# EAGLE design minimatrixV1 (EAGLE 5.11)
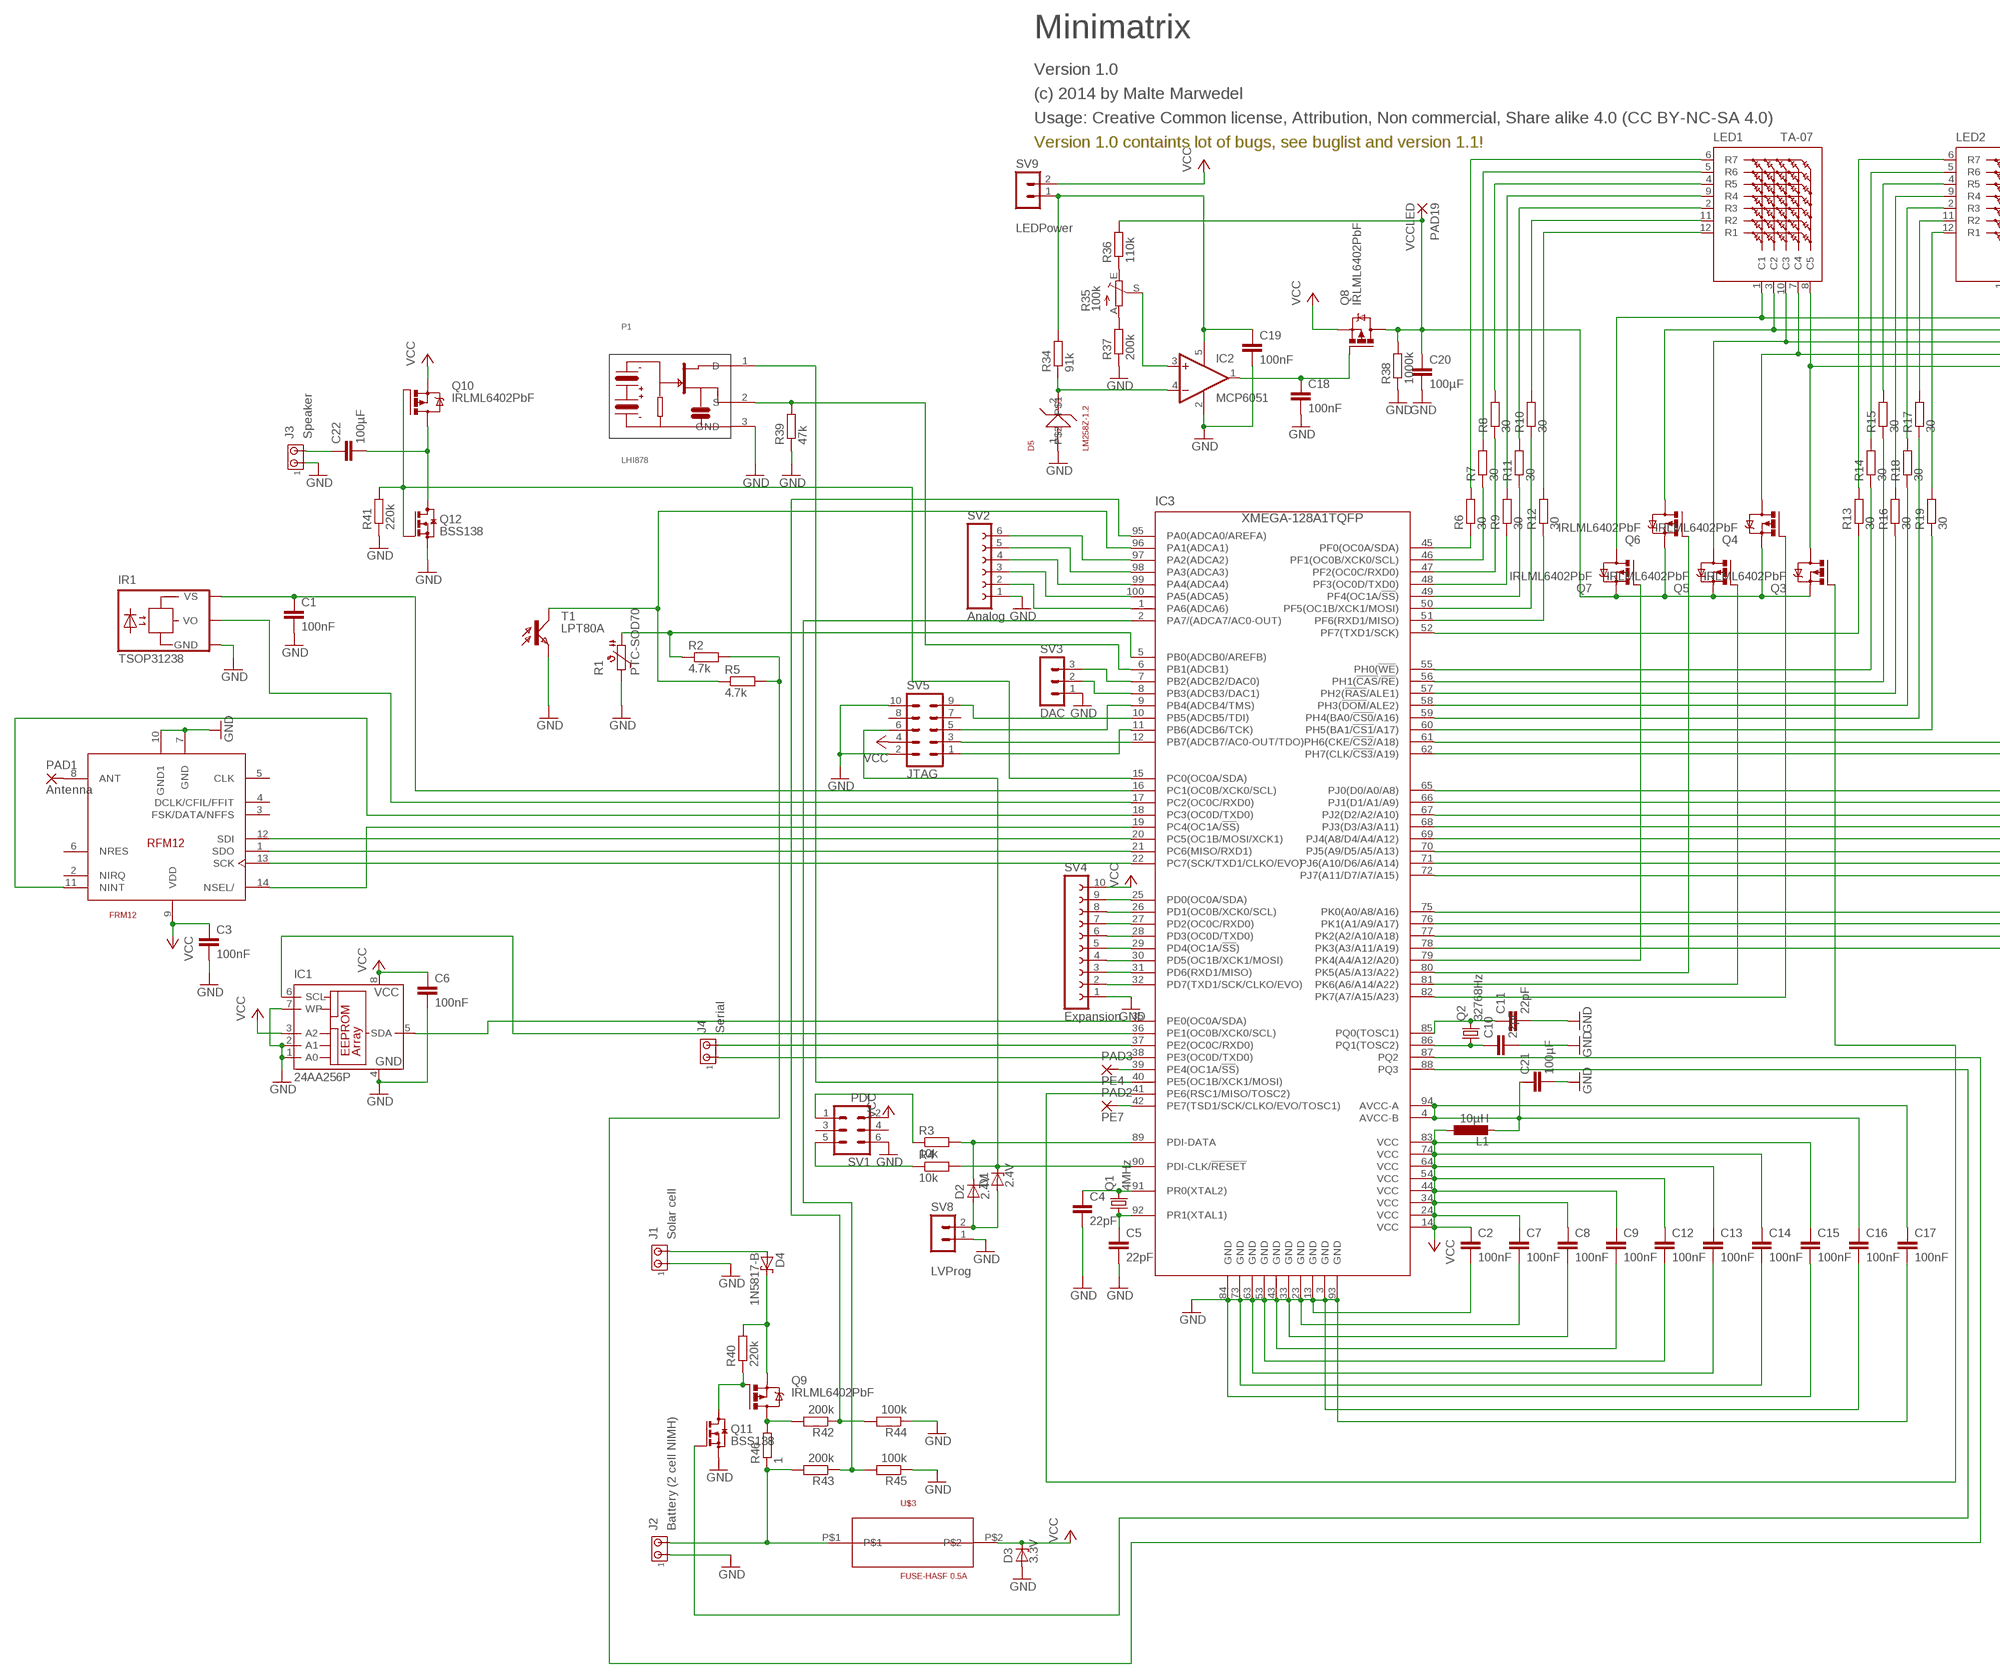
[diagram p0: schematic, sheet 1, part 1 of 2]
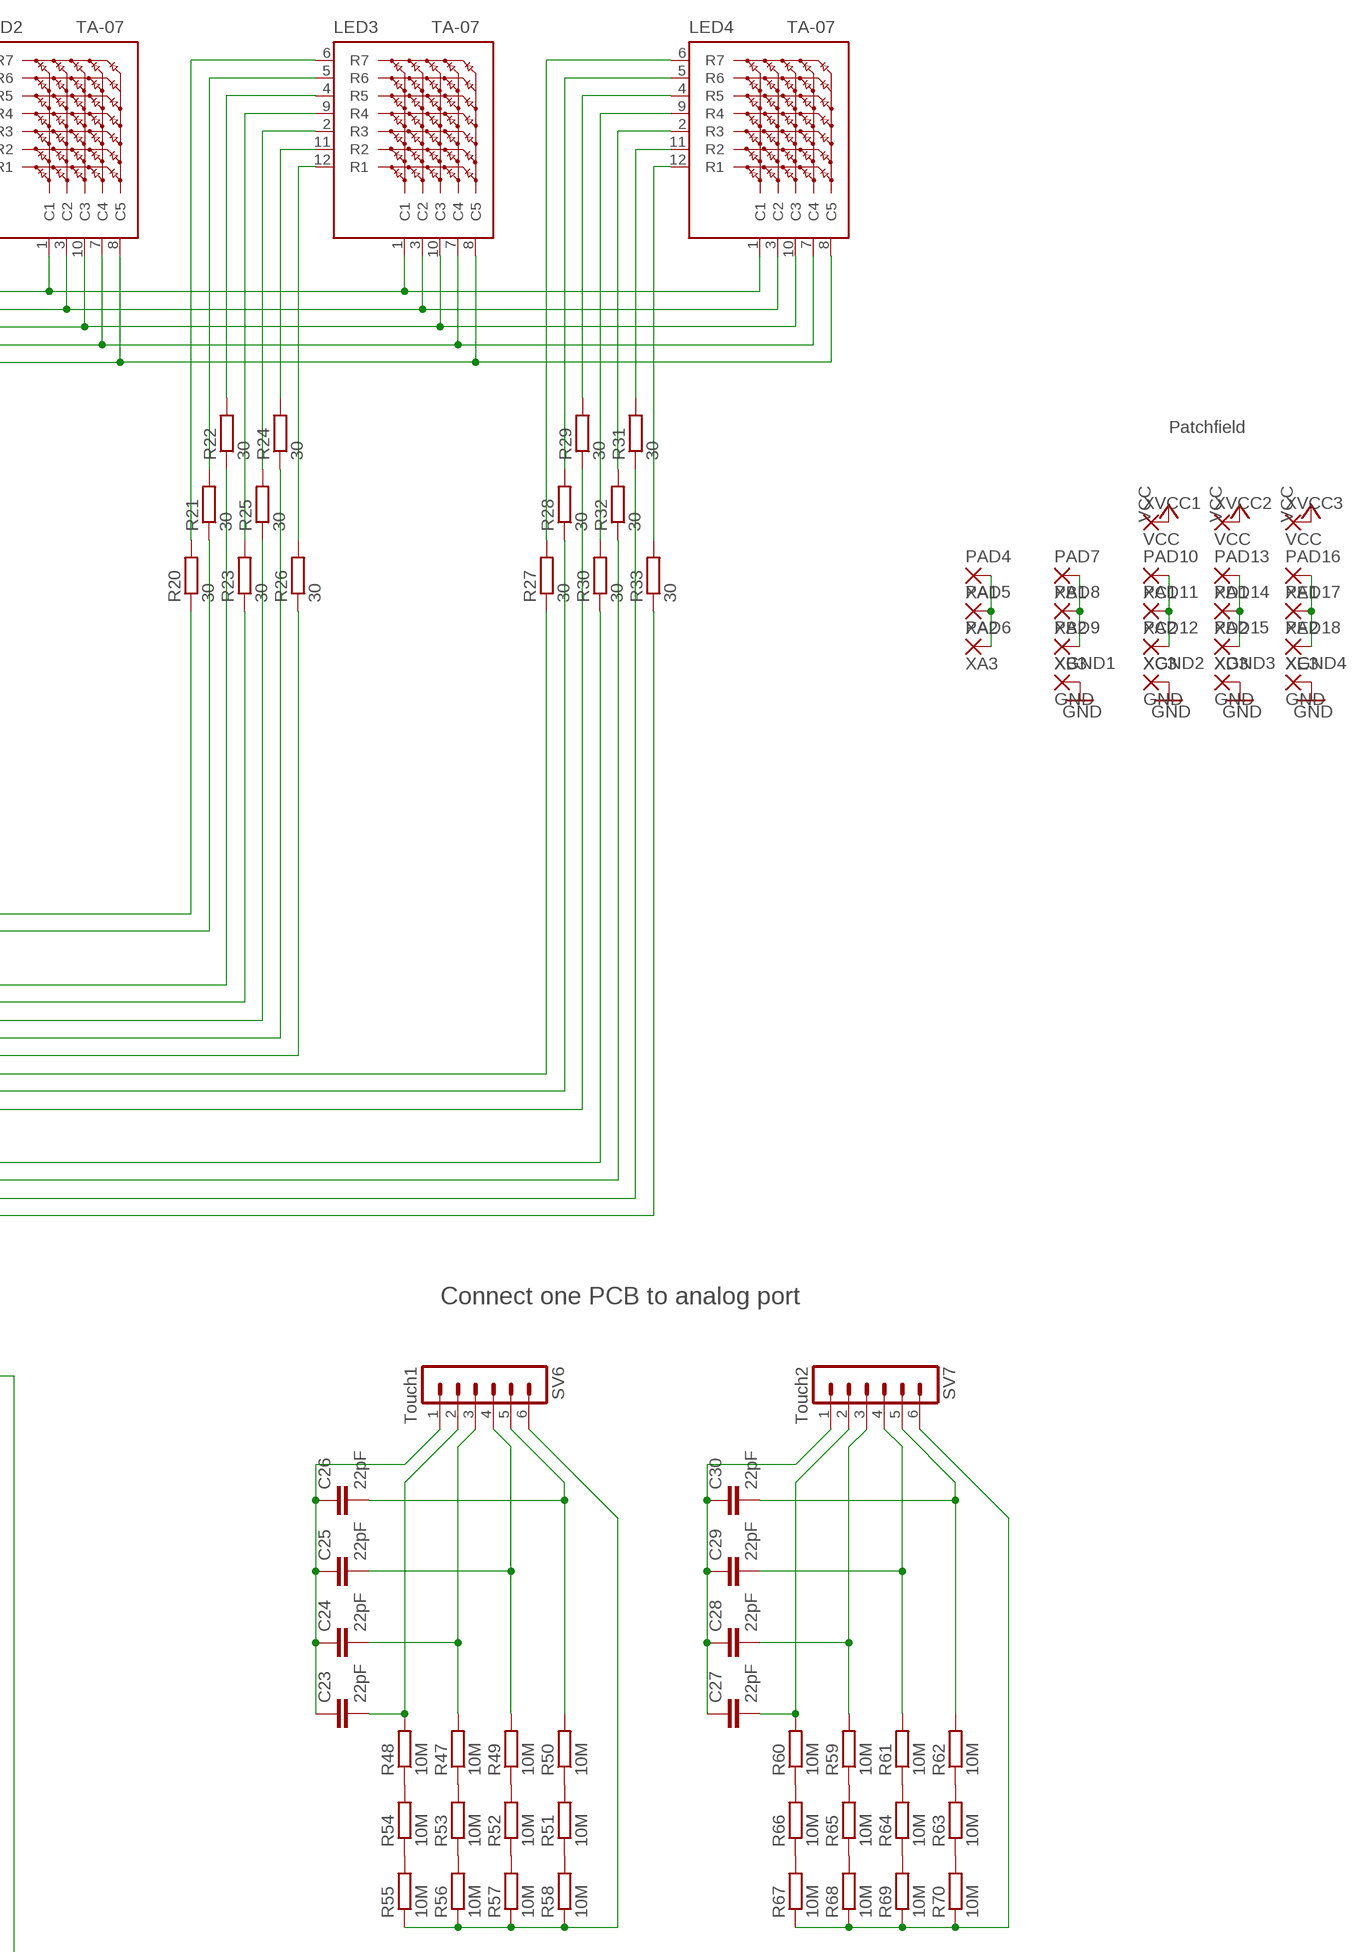
[diagram p1: schematic, sheet 1, part 2 of 2]

## Parts
C1  100nF  C-EUC0805  [C0805]
C2  100nF  C-EUC0805  [C0805]
C3  100nF  C-EUC0805  [C0805]
C4  22pF  C-EUC0805  [C0805]
C5  22pF  C-EUC0805  [C0805]
C6  100nF  C-EUC0805  [C0805]
C7  100nF  C-EUC0805  [C0805]
C8  100nF  C-EUC0805  [C0805]
C9  100nF  C-EUC0805  [C0805]
C10  22pF  C-EUC0805  [C0805]
C11  22pF  C-EUC0805  [C0805]
C12  100nF  C-EUC0805  [C0805]
C13  100nF  C-EUC0805  [C0805]
C14  100nF  C-EUC0805  [C0805]
C15  100nF  C-EUC0805  [C0805]
C16  100nF  C-EUC0805  [C0805]
C17  100nF  C-EUC0805  [C0805]
C18  100nF  C-EUC0805  [C0805]
C19  100nF  C-EUC0805  [C0805]
C20  100µF  C-EUC1206  [C1206]
C21  100µF  C-EUC1206  [C1206]
C22  100µF  C-EUC1206  [C1206]
C23  22pF  C-EUC0805  [C0805]
C24  22pF  C-EUC0805  [C0805]
C25  22pF  C-EUC0805  [C0805]
C26  22pF  C-EUC0805  [C0805]
C27  22pF  C-EUC0805  [C0805]
C28  22pF  C-EUC0805  [C0805]
C29  22pF  C-EUC0805  [C0805]
C30  22pF  C-EUC0805  [C0805]
D1  2.4V  ZENER-DIODEDO35Z10  [DO35Z10]
D2  2.4V  ZENER-DIODEDO35Z10  [DO35Z10]
D3  3.3V  ZENER-DIODEDO41Z10  [DO41Z10]
D4  1N5817-B  [DO41-7.6]
D5  LM258Z-1.2  LM258Z  [TO92L]
IC1  24AA256P  [DIL8]
IC2  MCP6051  MCP601OT  [SOT23-5]
IC3  XMEGA-128A1TQFP  XMEGA-A1TQFP  [TQFP100]
IR1  TSOP31238  TSOP17TB1HIGH  [TSOP17_ST]
J1  Solar cell  MTA02-100  [RM3.5X02MTA]
J2  Battery (2 cell NIMH)  MTA02-100  [RM3.5X02MTA]
J3  Speaker  MTA02-100  [RM3.5X02MTA]
J4  Serial  MTA02-100  [RM3.5X02MTA]
L1  10µH  L-EU0207/2V  [0207/2V]
LED1  TA-07  [TX07-11]
LED2  TA-07  [TX07-11]
LED3  TA-07  [TX07-11]
LED4  TA-07  [TX07-11]
P1  LHI878  [TO5]
PAD1  Antenna  1,6/0,8  [1,6/0,8]
PAD2  PE7  1,6/0,8  [1,6/0,8]
PAD3  PE4  1,6/0,8  [1,6/0,8]
PAD4  XA1  1,6/0,8  [1,6/0,8]
PAD5  XA2  1,6/0,8  [1,6/0,8]
PAD6  XA3  1,6/0,8  [1,6/0,8]
PAD7  XB1  1,6/0,8  [1,6/0,8]
PAD8  XB2  1,6/0,8  [1,6/0,8]
PAD9  XB3  1,6/0,8  [1,6/0,8]
PAD10  XC1  1,6/0,8  [1,6/0,8]
PAD11  XC2  1,6/0,8  [1,6/0,8]
PAD12  XC3  1,6/0,8  [1,6/0,8]
PAD13  XD1  1,6/0,8  [1,6/0,8]
PAD14  XD2  1,6/0,8  [1,6/0,8]
PAD15  XD3  1,6/0,8  [1,6/0,8]
PAD16  XE1  1,6/0,8  [1,6/0,8]
PAD17  XE2  1,6/0,8  [1,6/0,8]
PAD18  XE3  1,6/0,8  [1,6/0,8]
PAD19  VCCLED  1,6/0,8  [1,6/0,8]
Q1  4MHz  CRYSTALHC18U-V  [HC18U-V]
Q2  32768Hz  CRYSTALTC38H  [TC38H]
Q3  IRLML6402PbF  IRLML5203  [MICRO3]
Q4  IRLML6402PbF  IRLML5203  [MICRO3]
Q5  IRLML6402PbF  IRLML5203  [MICRO3]
Q6  IRLML6402PbF  IRLML5203  [MICRO3]
Q7  IRLML6402PbF  IRLML5203  [MICRO3]
Q8  IRLML6402PbF  IRLML5203  [MICRO3]
Q9  IRLML6402PbF  IRLML5203  [MICRO3]
Q10  IRLML6402PbF  IRLML5203  [MICRO3]
Q11  BSS138  BSS123  [SOT23]
Q12  BSS138  BSS123  [SOT23]
R1  PTC-SOD70  [SOD70]
R2  4.7k  R-EU_R0805  [R0805]
R3  10k  R-EU_R0805  [R0805]
R4  10k  R-EU_R0805  [R0805]
R5  4.7k  R-EU_R0805  [R0805]
R6  30  R-EU_R0805  [R0805]
R7  30  R-EU_R0805  [R0805]
R8  30  R-EU_R0805  [R0805]
R9  30  R-EU_R0805  [R0805]
R10  30  R-EU_R0805  [R0805]
R11  30  R-EU_R0805  [R0805]
R12  30  R-EU_R0805  [R0805]
R13  30  R-EU_R0805  [R0805]
R14  30  R-EU_R0805  [R0805]
R15  30  R-EU_R0805  [R0805]
R16  30  R-EU_R0805  [R0805]
R17  30  R-EU_R0805  [R0805]
R18  30  R-EU_R0805  [R0805]
R19  30  R-EU_R0805  [R0805]
R20  30  R-EU_R0805  [R0805]
R21  30  R-EU_R0805  [R0805]
R22  30  R-EU_R0805  [R0805]
R23  30  R-EU_R0805  [R0805]
R24  30  R-EU_R0805  [R0805]
R25  30  R-EU_R0805  [R0805]
R26  30  R-EU_R0805  [R0805]
R27  30  R-EU_R0805  [R0805]
R28  30  R-EU_R0805  [R0805]
R29  30  R-EU_R0805  [R0805]
R30  30  R-EU_R0805  [R0805]
R31  30  R-EU_R0805  [R0805]
R32  30  R-EU_R0805  [R0805]
R33  30  R-EU_R0805  [R0805]
R34  91k  R-EU_R0805  [R0805]
R35  100k  TRIM_EU-CA6H  [CA6H]
R36  110k  R-EU_R0805  [R0805]
R37  200k  R-EU_R0805  [R0805]
R38  1000k  R-EU_R0805  [R0805]
R39  47k  R-EU_R0805  [R0805]
R40  220k  R-EU_R0805  [R0805]
R41  220k  R-EU_R0805  [R0805]
R42  200k  R-EU_R0805  [R0805]
R43  200k  R-EU_R0805  [R0805]
R44  100k  R-EU_R0805  [R0805]
R45  100k  R-EU_R0805  [R0805]
R46  1  R-EU_0414/15  [0414/15]
R47  10M  R-EU_R0805  [R0805]
R48  10M  R-EU_R0805  [R0805]
R49  10M  R-EU_R0805  [R0805]
R50  10M  R-EU_R0805  [R0805]
R51  10M  R-EU_R0805  [R0805]
R52  10M  R-EU_R0805  [R0805]
R53  10M  R-EU_R0805  [R0805]
R54  10M  R-EU_R0805  [R0805]
R55  10M  R-EU_R0805  [R0805]
R56  10M  R-EU_R0805  [R0805]
R57  10M  R-EU_R0805  [R0805]
R58  10M  R-EU_R0805  [R0805]
R59  10M  R-EU_R0805  [R0805]
R60  10M  R-EU_R0805  [R0805]
R61  10M  R-EU_R0805  [R0805]
R62  10M  R-EU_R0805  [R0805]
R63  10M  R-EU_R0805  [R0805]
R64  10M  R-EU_R0805  [R0805]
R65  10M  R-EU_R0805  [R0805]
R66  10M  R-EU_R0805  [R0805]
R67  10M  R-EU_R0805  [R0805]
R68  10M  R-EU_R0805  [R0805]
R69  10M  R-EU_R0805  [R0805]
R70  10M  R-EU_R0805  [R0805]
SV1  PDI  MA03-2  [MA03-2]
SV2  Analog  FE06-1  [FE06]
SV3  DAC  MA03-1  [MA03-1]
SV4  Expansion  FE10-1  [FE10]
SV5  JTAG  MA05-2  [MA05-2]
SV6  Touch1  MA06-1  [MA06-1]
SV7  Touch2  MA06-1  [MA06-1]
SV8  LVProg  MA02-1  [MA02-1]
SV9  LEDPower  MA02-1  [MA02-1]
T1  LPT80A  [LPT80A]
U$2  FRM12  [RFM12]
U$3  FUSE-HASF 0.5A  FUSE-HASF  [FUSE-SMD-HASF]
XGND1  GND  1,6/0,8  [1,6/0,8]
XGND2  GND  1,6/0,8  [1,6/0,8]
XGND3  GND  1,6/0,8  [1,6/0,8]
XGND4  GND  1,6/0,8  [1,6/0,8]
XVCC1  VCC  1,6/0,8  [1,6/0,8]
XVCC2  VCC  1,6/0,8  [1,6/0,8]
XVCC3  VCC  1,6/0,8  [1,6/0,8]

## Nets
AVCC: C16.1 C17.1 C21.1 IC3.4(AVCC-B) IC3.94(AVCC-A) L1.2
GND: C1.2 C2.2 C3.2 C4.2 C5.2 C6.2 C7.2 C8.2 C9.2 C10.2 C11.2 C12.2 C13.2 C14.2 C15.2 C16.2 C17.2 C18.2 C19.2 C20.2 C21.2 D3.A D5.1 IC1.1(A0) IC1.2(A1) IC1.4(GND) IC1.7(WP) IC2.2(V-) IC3.3(GND) IC3.13(GND) IC3.23(GND) IC3.33(GND) IC3.43(GND) IC3.53(GND) IC3.63(GND) IC3.73(GND) IC3.84(GND) IC3.93(GND) IR1.GND J1.1 J2.1 J3.1 P1.3(GND) Q11.2(S) Q12.2(S) R1.2 R37.1 R38.1 R39.1 R41.1 R44.1 R45.1 SV1.6 SV2.1 SV3.1 SV4.1 SV5.2 SV5.10 SV8.1 T1.E U$2.7(GND) U$2.10(GND1) XGND1.1(P) XGND2.1(P) XGND3.1(P) XGND4.1(P)
N$1: IC3.20(PC5(OC1B/MOSI/XCK1)) U$2.12(SDI)
N$2: IC3.21(PC6(MISO/RXD1)) U$2.1(SDO)
N$3: IC3.22(PC7(SCK/TXD1/CLKO/EVO)) U$2.13(SCK)
N$4: IC3.19(PC4(OC1A/!SS!)) U$2.14(NSEL/)
N$5: IC3.18(PC3(OC0D/TXD0)) U$2.11(NINT)
N$6: C1.1 IC3.16(PC1(OC0B/XCK0/SCL)) IR1.VS
N$7: PAD1.1(P) U$2.8(ANT)
N$8: IC3.17(PC2(OC0C/RXD0)) IR1.VO
N$9: R3.1 SV1.1
N$10: D2.C IC3.89(PDI-DATA) R3.2
N$11: IC3.87(PQ2) R2.2 R5.2
N$12: C4.1 IC3.91(PR0(XTAL2)) Q1.2
N$13: C5.1 IC3.92(PR1(XTAL1)) Q1.1
N$14: IC3.79(PK4(A4/A12/A20)) Q7.1(G)
N$15: IC1.5(SDA) IC3.35(PE0(OC0A/SDA))
N$16: IC1.6(SCL) IC3.36(PE1(OC0B/XCK0/SCL))
N$17: IC3.5(PB0(ADCB0/AREFB)) R1.1 R2.1
N$18: D1.C IC3.90(PDI-CLK/!RESET) R4.2 SV5.6
N$19: R4.1 SV1.5
N$20: C11.1 IC3.85(PQ0(TOSC1)) Q2.2
N$21: C10.1 IC3.86(PQ1(TOSC2)) Q2.1
N$22: IC3.97(PA2(ADCA2)) SV2.6
N$23: IC3.98(PA3(ADCA3)) SV2.5
N$24: IC3.99(PA4(ADCA4)) SV2.4
N$25: IC3.100(PA5(ADCA5)) SV2.3
N$26: IC3.1(PA6(ADCA6)) SV2.2
N$27: IC3.96(PA1(ADCA1)) R5.1 T1.C
N$28: LED1.1(C1) LED2.1(C1) LED3.1(C1) LED4.1(C1) Q7.3(D)
N$29: IC3.9(PB4(ADCB4/TMS)) SV5.5
N$30: IC3.10(PB5(ADCB5/TDI)) SV5.9
N$31: IC3.11(PB6(ADCB6/TCK)) SV5.1
N$32: IC3.12(PB7(ADCB7/AC0-OUT/TDO)) SV5.3
N$33: LED1.3(C2) LED2.3(C2) LED3.3(C2) LED4.3(C2) Q6.3(D)
N$34: LED1.10(C3) LED2.10(C3) LED3.10(C3) LED4.10(C3) Q5.3(D)
N$35: LED1.7(C4) LED2.7(C4) LED3.7(C4) LED4.7(C4) Q4.3(D)
N$36: LED1.8(C5) LED2.8(C5) LED3.8(C5) LED4.8(C5) Q3.3(D)
N$37: LED1.6(R7) R6.2
N$38: LED1.5(R6) R7.2
N$39: LED1.4(R5) R8.2
N$40: LED1.9(R4) R9.2
N$41: LED1.2(R3) R11.2
N$42: LED1.11(R2) R10.2
N$43: LED1.12(R1) R12.2
N$44: IC3.50(PF5(OC1B/XCK1/MOSI)) R10.1
N$45: IC3.48(PF3(OC0D/TXD0)) R9.1
N$46: IC3.46(PF1(OC0B/XCK0/SCL)) R7.1
N$47: IC3.45(PF0(OC0A/SDA)) R6.1
N$48: IC3.47(PF2(OC0C/RXD0)) R8.1
N$49: IC3.49(PF4(OC1A/!SS!)) R11.1
N$50: IC3.51(PF6(RXD1/MISO)) R12.1
N$51: LED2.6(R7) R13.2
N$52: LED2.5(R6) R14.2
N$53: LED2.4(R5) R15.2
N$54: LED2.9(R4) R16.2
N$55: LED2.2(R3) R18.2
N$56: LED2.11(R2) R17.2
N$57: LED2.12(R1) R19.2
N$58: IC3.59(PH4(BA0/!CS0!/A16)) R17.1
N$59: IC3.57(PH2(!RAS!/ALE1)) R16.1
N$60: IC3.55(PH0(!WE!)) R14.1
N$61: IC3.52(PF7(TXD1/SCK)) R13.1
N$62: IC3.56(PH1(!CAS!/!RE!)) R15.1
N$63: IC3.58(PH3(!DOM!/ALE2)) R18.1
N$64: IC3.60(PH5(BA1/!CS1!/A17)) R19.1
N$65: J2.2 R43.2 R46.1 U$3.P$1
N$66: LED3.6(R7) R20.2
N$67: LED3.5(R6) R21.2
N$68: LED3.4(R5) R22.2
N$69: LED3.9(R4) R23.2
N$70: LED3.2(R3) R25.2
N$71: LED3.11(R2) R24.2
N$72: LED3.12(R1) R26.2
N$73: IC3.68(PJ3(D3/A3/A11)) R24.1
N$74: IC3.66(PJ1(D1/A1/A9)) R23.1
N$75: IC3.62(PH7(CLK/!CS3!/A19)) R21.1
N$76: IC3.61(PH6(CKE/!CS2!/A18)) R20.1
N$77: IC3.65(PJ0(D0/A0/A8)) R22.1
N$78: IC3.67(PJ2(D2/A2/A10)) R25.1
N$79: IC3.69(PJ4(A8/D4/A4/A12)) R26.1
N$80: LED4.6(R7) R27.2
N$81: LED4.5(R6) R28.2
N$82: LED4.4(R5) R29.2
N$83: LED4.9(R4) R30.2
N$84: LED4.2(R3) R32.2
N$85: LED4.11(R2) R31.2
N$86: LED4.12(R1) R33.2
N$87: IC3.77(PK2(A2/A10/A18)) R31.1
N$88: IC3.75(PK0(A0/A8/A16)) R30.1
N$89: IC3.71(PJ6(A10/D6/A6/A14)) R28.1
N$90: IC3.70(PJ5(A9/D5/A5/A13)) R27.1
N$91: IC3.72(PJ7(A11/D7/A7/A15)) R29.1
N$92: IC3.76(PK1(A1/A9/A17)) R32.1
N$93: IC3.78(PK3(A3/A11/A19)) R33.1
N$94: D4.A J1.2
N$95: IC3.80(PK5(A5/A13/A22)) Q6.1(G)
N$96: C20.1 PAD19.1(P) Q3.2(S) Q4.2(S) Q5.2(S) Q6.2(S) Q7.2(S) Q8.3(D) R36.2 R38.2
N$97: IC3.81(PK6(A6/A14/A22)) Q5.1(G)
N$98: IC3.82(PK7(A7/A15/A23)) Q4.1(G)
N$99: IC3.41(PE6(RSC1/MISO/TOSC2)) Q3.1(G)
N$100: C18.1 IC2.1(OUT) Q8.1(G)
N$101: D5.2 IC2.4(-IN) R34.1
N$102: R35.E R36.1
N$103: R35.A R37.2
N$104: IC3.6(PB1(ADCB1)) P1.2(S) R39.2
N$105: IC2.3(+IN) R35.S
N$106: IC3.40(PE5(OC1B/XCK1/MOSI)) P1.1(D)
N$107: IC3.25(PD0(OC0A/SDA)) SV4.9
N$108: IC3.26(PD1(OC0B/XCK0/SCL)) SV4.8
N$109: IC3.27(PD2(OC0C/RXD0)) SV4.7
N$110: IC3.28(PD3(OC0D/TXD0)) SV4.6
N$111: IC3.29(PD4(OC1A/!SS!)) SV4.5
N$112: IC3.30(PD5(OC1B/XCK1/MOSI)) SV4.4
N$113: IC3.31(PD6(RXD1/MISO)) SV4.3
N$114: IC3.32(PD7(TXD1/SCK/CLKO/EVO)) SV4.2
N$115: D4.C Q9.2(S) R40.2
N$116: Q9.1(G) Q11.3(D) R40.1
N$117: Q9.3(D) R42.2 R46.2
N$118: IC3.2(PA7/(ADCA7/AC0-OUT)) R43.1 R45.2
N$119: IC3.95(PA0(ADCA0/AREFA)) R42.1 R44.2
N$120: IC3.37(PE2(OC0C/RXD0)) J4.2
N$121: IC3.38(PE3(OC0D/TXD0)) J4.1
N$122: IC3.42(PE7(TSD1/SCK/CLKO/EVO/TOSC1)) PAD2.1(P)
N$123: IC3.88(PQ3) Q11.1(G)
N$124: C22.2 Q10.3(D) Q12.3(D)
N$125: IC3.15(PC0(OC0A/SDA)) Q10.1(G) Q12.1(G) R41.2
N$126: C22.1 J3.2
N$127: IC3.39(PE4(OC1A/!SS!)) PAD3.1(P)
N$128: IC3.7(PB2(ADCB2/DAC0)) SV3.3
N$129: IC3.8(PB3(ADCB3/DAC1)) SV3.2
N$130: R55.1 R56.1 R57.1 R58.1 SV6.6
N$131: D1.A D2.A SV8.2
N$132: C19.1 IC2.5(V+) R34.2 SV9.1
N$134: R50.1 R51.2
N$135: R49.1 R52.2
N$136: R47.1 R53.2
N$137: R48.1 R54.2
N$138: R54.1 R55.2
N$139: R53.1 R56.2
N$140: R52.1 R57.2
N$141: R51.1 R58.2
N$143: R62.1 R63.2
N$144: R61.1 R64.2
N$145: R59.1 R65.2
N$146: R60.1 R66.2
N$147: R66.1 R67.2
N$148: R65.1 R68.2
N$149: R64.1 R69.2
N$150: R63.1 R70.2
N$151: R67.1 R68.1 R69.1 R70.1 SV7.6
N$156: PAD4.1(P) PAD5.1(P) PAD6.1(P)
N$157: PAD7.1(P) PAD8.1(P) PAD9.1(P)
N$158: PAD10.1(P) PAD11.1(P) PAD12.1(P)
N$159: PAD13.1(P) PAD14.1(P) PAD15.1(P)
N$160: PAD16.1(P) PAD17.1(P) PAD18.1(P)
NT1: C26.2 R50.2 SV6.5
NT2: C25.2 R49.2 SV6.4
NT3: C24.2 R47.2 SV6.3
NT4: C23.2 R48.2 SV6.2
NTGND: C23.1 C24.1 C25.1 C26.1 SV6.1
NU1: C30.2 R62.2 SV7.5
NU2: C29.2 R61.2 SV7.4
NU3: C28.2 R59.2 SV7.3
NU4: C27.2 R60.2 SV7.2
NUGND: C27.1 C28.1 C29.1 C30.1 SV7.1
VCC: C2.1 C3.1 C6.1 C7.1 C8.1 C9.1 C12.1 C13.1 C14.1 C15.1 D3.C IC1.3(A2) IC1.8(VCC) IC3.14(VCC) IC3.24(VCC) IC3.34(VCC) IC3.44(VCC) IC3.54(VCC) IC3.64(VCC) IC3.74(VCC) IC3.83(VCC) L1.1 Q8.2(S) Q10.2(S) SV1.2 SV4.10 SV5.4 SV9.2 U$2.9(VDD) U$3.P$2 XVCC1.1(P) XVCC2.1(P) XVCC3.1(P)
Unconnected: SV1.3 SV1.4 SV5.7 SV5.8 U$2.2(NIRQ) U$2.3(FSK/DATA/NFFS) U$2.4(DCLK/CFIL/FFIT) U$2.5(CLK) U$2.6(NRES)

## Notes on the sheet
- Minimatrix
- Version 1.0
- (c) 2014 by Malte Marwedel
- Usage: Creative Common license, Attribution, Non commercial, Share alike 4.0 (CC BY-NC-SA 4.0)
- Version 1.0 containts lot of bugs, see buglist and version 1.1!
- Patchfield
- Connect one PCB to analog port

## Library data of the parts
C1-C30 = rcl:C-EU: CAPACITOR, European symbol
D1-D3 = diode:ZENER-DIODE: Z-Diode
D4 = diode:1N581*: 1.0A SCHOTTKY BARRIER RECTIFIER Source: http://www.diodes.com/datasheets/ds23001.pdf
D5 = maltes2_lib:LM258Z: LM185Z / LM285Z / LM385Z Micropower voltage reference diode LM285Z-1.2 -> 1,25V ref voltage.
IC1 = microchip:24*: Serial EEPROM I2C; MF: MICROCHIP; MPN: 24AA256-I/P; OC_FARNELL: 1331294; OC_NEWARK: 92C6872
IC2 = linear:MCP601: Single Op Amp 2.7V to 6.0V Single Supply CMOS Source: http://ww1.microchip.com/downloads/en/DeviceDoc/21314g.pdf
IC3 = avr-7:XMEGA-A1: Atmel XMega A1 Series processor
IR1 = maltes_lib:TSOP17*TB1: TSOP17..TB1 IR Receiver Modules for Remote Control Systems Source: http://www.vishay.com/docs/82042/82042.pdf
J1-J4 = maltes2_lib:MTA02-100: AMP connector; OC_FARNELL: unknown; OC_NEWARK: unknown
L1 = rcl:L-EU: INDUCTOR, European symbol
LED1-LED4 = maltes2_lib:TA-07: 18mm (0.7 INCH) 5x7 DOT MATRIX DISPLAY
P1 = maltes2_lib:LHI878: LHI 878 PIR Sensor
PAD1-PAD19 XGND1-XGND4 XVCC1-XVCC3 = wirepad:1,6/0,8: THROUGH-HOLE PAD
Q1 Q2 = crystal:CRYSTAL: CRYSTAL; OC_FARNELL: unknown; OC_NEWARK: unknown
Q3-Q10 = transistor-power:IRLML5203: HEXFET P-Channel Power MOSFET
Q11 Q12 = transistor-small-signal:BSS123: N-CHANNEL MOS FET
R1 = ptc-ntc:PTC-: Positive Temperature Coefficient Resistor (PTC) termistor Philips KTY81-210 - KTY81-252 Source: 153627-da-01-en-Temperatur-Sensor_KTY10-6_Philips.pdf; OC_FARNELL: unknown; OC_NEWARK: unknown
R2-R34 R36-R70 = rcl:R-EU_: RESISTOR, European symbol
R35 = maltes2_lib:TRIM_EU-: POTENTIOMETER
SV1 = con-lstb:MA03-2: PIN HEADER; OC_FARNELL: unknown; OC_NEWARK: unknown
SV2 = con-lsta:FE06-1: FEMALE HEADER; OC_FARNELL: unknown; OC_NEWARK: unknown
SV3 = con-lstb:MA03-1: PIN HEADER; OC_FARNELL: unknown; OC_NEWARK: unknown
SV4 = con-lsta:FE10-1: FEMALE HEADER; OC_FARNELL: unknown; OC_NEWARK: unknown
SV5 = con-lstb:MA05-2: PIN HEADER; OC_FARNELL: unknown; OC_NEWARK: unknown
SV6 SV7 = con-lstb:MA06-1: PIN HEADER; OC_FARNELL: unknown; OC_NEWARK: unknown
SV8 SV9 = maltes_lib:MA02-1: PIN HEADER
T1 = opto-trans-siemens:LPT80A: PHOTO TRANSISTOR; OC_FARNELL: unknown; OC_NEWARK: unknown
U$2 = RFM12:FRM12
U$3 = maltes_lib:FUSE-HASF

## Board
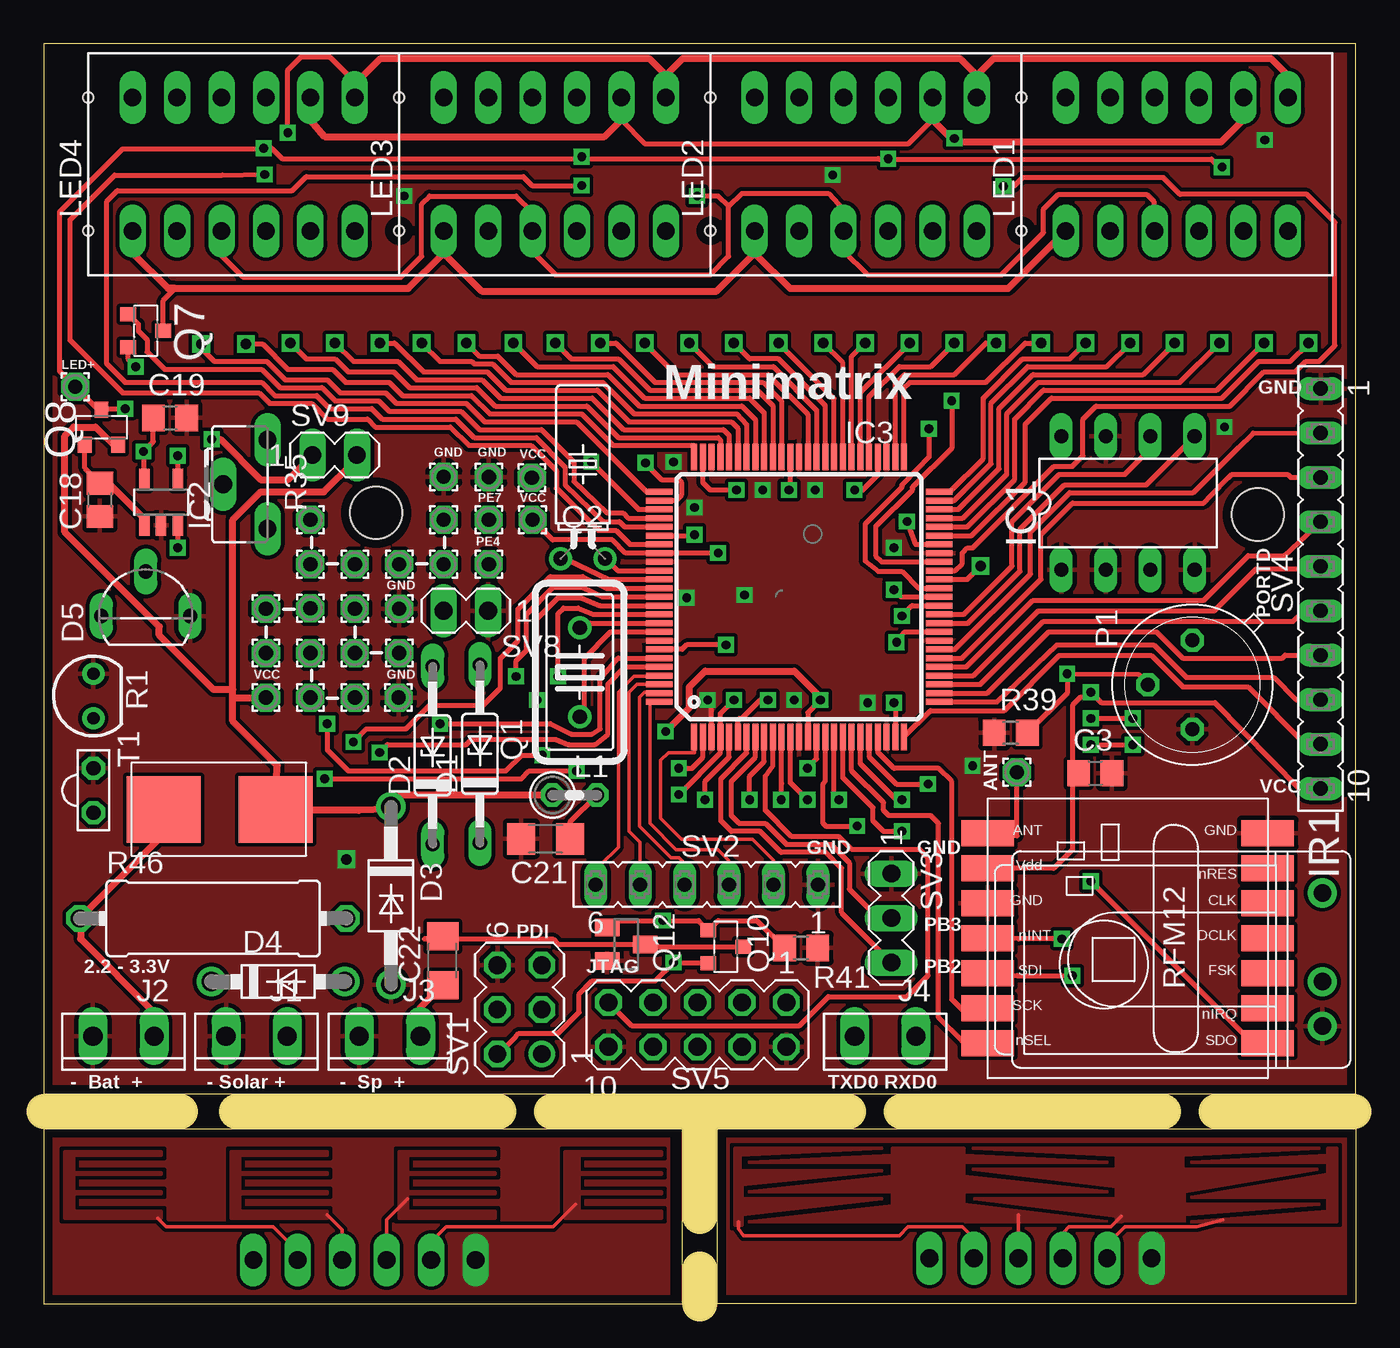
[diagram p2: board, top side]
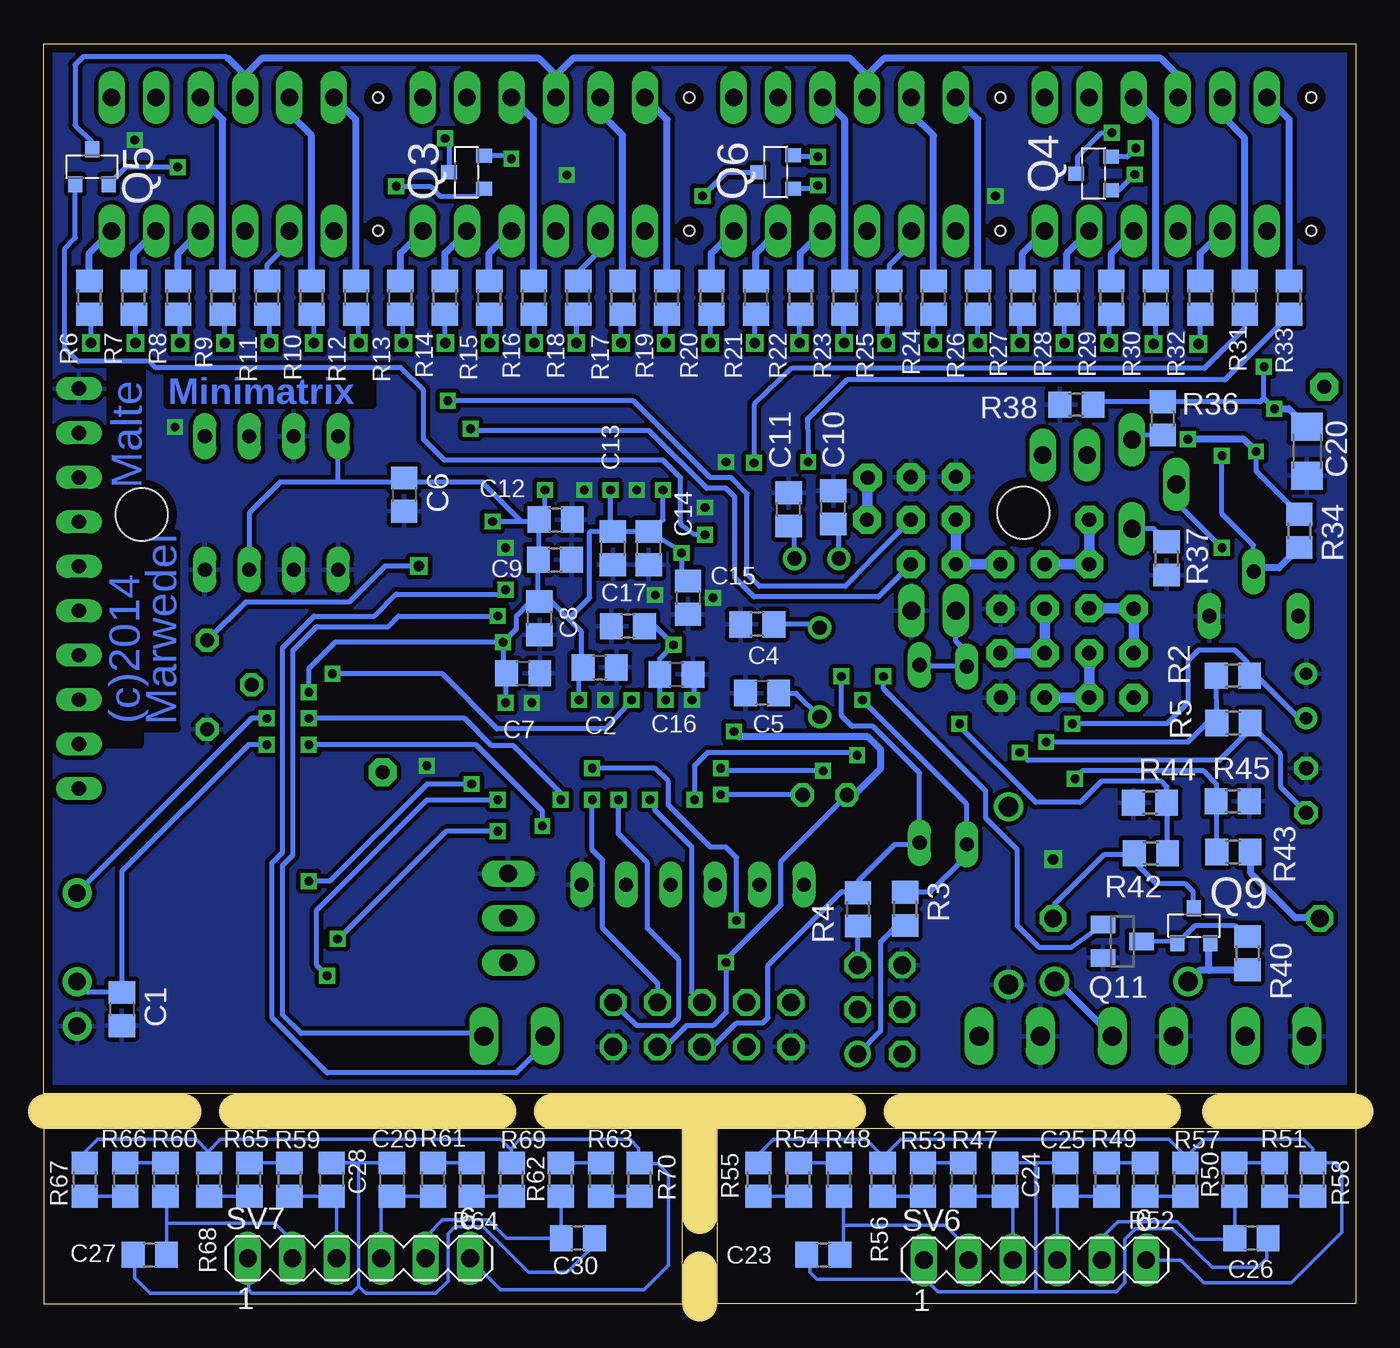
[diagram p3: board, bottom side, seen from below]

Size 75 x 72 mm. Coordinates in mm from the lower left corner, seen from the top.
Outline: 0,12 75,12 75,72 0,72 0,12
Outline: 0,10 0,0 36.5,0 36.5,10 0,10
Outline: 38.5,0 38.5,10 75,10 75,0 38.5,0
Copper layers (1*16): Top 0.035mm / dielectric 1.5mm / Bottom 0.035mm
Design rules "myDefaultThin-2014-01-16": minimum track width 0.2mm, minimum drill 0.3mm, track to track 0.15mm, track to pad 0.15mm, pad to pad 0.15mm, via to via 0.2mm, smd to smd 0.15mm, copper to edge 0.5mm, drill to drill 1mm, minimum pad ring 10mil, minimum via ring 8mil, stop-mask expansion 4mil, vias tented up to drill 0mil, thermal gap 10mil
Holes 3 mm at 69.4,45.1 19,45.2
Milling: 8 lines

### Footprints (pad centres in the part's own frame; a part is rotated, then mirrored left to right if it is on the bottom)
C0805 = smd 1.3 x 1.5: 1 -0.95,0; 2 0.95,0
C1206 = smd 1.6 x 1.8: 1 -1.4,0; 2 1.4,0
DO35Z10 = drill 0.813 long: A 5.08,0; C -5.08,0
DO41Z10 = drill 1.118 round: A 5.08,0; C -5.08,0
DO41-7.6 = drill 1.1 pad 1.7 round: A 3.81,0; C -3.81,0
TO92L = drill 0.813 long: 1 0,-2.54; 2 2.54,0; 3 0,2.54
DIL8 = drill 0.813 long: 1 -3.81,-3.81; 2 -1.27,-3.81; 3 1.27,-3.81; 4 3.81,-3.81; 5 3.81,3.81; 6 1.27,3.81; 7 -1.27,3.81; 8 -3.81,3.81
SOT23-5 = smd 0.6 x 1.2: 1 -0.95,-1.306; 2 0,-1.306; 3 0.95,-1.306; 4 0.95,1.306; 5 -0.95,1.306
TQFP100 = smd 1.5 x 0.35: 1 -8,6; 2 -8,5.5; 3 -8,5; 4 -8,4.5; 5 -8,4; 6 -8,3.5; 7 -8,3; 8 -8,2.5; 9 -8,2; 10 -8,1.5; 11 -8,1; 12 -8,0.5; 13 -8,0; 14 -8,-0.5; 15 -8,-1; 16 -8,-1.5; 17 -8,-2; 18 -8,-2.5; 19 -8,-3; 20 -8,-3.5; 21 -8,-4; 22 -8,-4.5; 23 -8,-5; 24 -8,-5.5; 25 -8,-6; 51 8,-6; 52 8,-5.5; 53 8,-5; 54 8,-4.5; 55 8,-4; 56 8,-3.5; 57 8,-3; 58 8,-2.5; 59 8,-2; 60 8,-1.5; 61 8,-1; 62 8,-0.5; 63 8,0; 64 8,0.5; 65 8,1; 66 8,1.5; 67 8,2; 68 8,2.5; 69 8,3; 70 8,3.5; 71 8,4; 72 8,4.5; 73 8,5; 74 8,5.5; 75 8,6 | smd 0.35 x 1.5: 26 -6,-8; 27 -5.5,-8; 28 -5,-8; 29 -4.5,-8; 30 -4,-8; 31 -3.5,-8; 32 -3,-8; 33 -2.5,-8; 34 -2,-8; 35 -1.5,-8; 36 -1,-8; 37 -0.5,-8; 38 0,-8; 39 0.5,-8; 40 1,-8; 41 1.5,-8; 42 2,-8; 43 2.5,-8; 44 3,-8; 45 3.5,-8; 46 4,-8; 47 4.5,-8; 48 5,-8; 49 5.5,-8; 50 6,-8; 76 6,8; 77 5.5,8; 78 5,8; 79 4.5,8; 80 4,8; 81 3.5,8; 82 3,8; 83 2.5,8; 84 2,8; 85 1.5,8; 86 1,8; 87 0.5,8; 88 0,8; 89 -0.5,8; 90 -1,8; 91 -1.5,8; 92 -2,8; 93 -2.5,8; 94 -3,8; 95 -3.5,8; 96 -4,8; 97 -4.5,8; 98 -5,8; 99 -5.5,8; 100 -6,8
TSOP17_ST = drill 1 pad 1.676 round: GND 0,-5.08; VO 0,2.54; VS 0,-2.54
RM3.5X02MTA = drill 1.1 long: 1 1.75,0; 2 -1.75,0
0207/2V = drill 0.813 octagon: 1 -1.27,0; 2 1.27,0
TX07-11 = drill 1 long: 1 -6.35,-3.81; 2 -3.81,-3.81; 3 -1.27,-3.81; 4 1.27,-3.81; 5 3.81,-3.81; 6 6.35,-3.81; 7 6.35,3.81; 8 3.81,3.81; 9 1.27,3.81; 10 -1.27,3.81; 11 -3.81,3.81; 12 -6.35,3.81 | hole 0.6: -8.89,3.81; -8.89,-3.81
TO5 = drill 0.813 octagon: 1 0,-2.54; 2 2.54,0; 3 0,2.54
1,6/0,8 = drill 0.813 pad 1.6 octagon: 1 0,0
HC18U-V = drill 0.813 round: 1 -2.54,0; 2 2.54,0
TC38H = drill 0.813 round: 1 -1.27,0; 2 1.27,0
MICRO3 = smd 0.8 x 0.9: 1 -0.95,-1; 2 0.95,-1; 3 0,1
SOT23 = smd 1 x 1.4: 1 -0.95,-1.1; 2 0.95,-1.1; 3 0,1.1
SOD70 = drill 0.7 pad 1.27 round: 1 -1.27,0; 2 1.27,0
R0805 = smd 1.3 x 1.5: 1 -0.95,0; 2 0.95,0
CA6H = drill 1.016 long: A -2.54,0; E 2.54,0; S 0,2.54
0414/15 = drill 1.016 octagon: 1 -7.62,0; 2 7.62,0
MA03-2 = drill 1.016 round: 1 -2.54,-1.27 | drill 1.016 octagon: 2 -2.54,1.27; 3 0,-1.27; 4 0,1.27; 5 2.54,-1.27; 6 2.54,1.27
FE06 = drill 0.813 long: 1 -6.35,0; 2 -3.81,0; 3 -1.27,0; 4 1.27,0; 5 3.81,0; 6 6.35,0
MA03-1 = drill 1.016 long: 1 -2.54,0; 2 0,0; 3 2.54,0
FE10 = drill 0.813 long: 1 -11.43,0; 2 -8.89,0; 3 -6.35,0; 4 -3.81,0; 5 -1.27,0; 6 1.27,0; 7 3.81,0; 8 6.35,0; 9 8.89,0; 10 11.43,0
MA05-2 = drill 1.016 octagon: 1 -5.08,-1.27; 2 -5.08,1.27; 3 -2.54,-1.27; 4 -2.54,1.27; 5 0,-1.27; 6 0,1.27; 7 2.54,-1.27; 8 2.54,1.27; 9 5.08,-1.27; 10 5.08,1.27
MA06-1 = drill 1.016 long: 1 -6.35,0; 2 -3.81,0; 3 -1.27,0; 4 1.27,0; 5 3.81,0; 6 6.35,0
MA02-1 = drill 1.016 long: 1 -2.54,0; 2 0,0
LPT80A = drill 0.813 octagon: C 0,-1.27; E 0,1.27
RFM12 = smd 1.5 x 3: 1 -5,-10; 2 -3,-10; 3 -1,-10; 4 1,-10; 5 3,-10; 6 5,-10; 7 7,-10; 8 7,6; 9 5,6; 10 3,6; 11 1,6; 12 -1,6; 13 -3,6; 14 -5,6
FUSE-SMD-HASF = smd 4.24 x 3.81: P$1 -3.15,-0.05; P$2 3.24,-0.05

### Placement (x,y rotation side)
C1  70.53,16.84 270 bottom
C2  43.22,36.36 0 bottom
C3  60.11,30.32 0 top
C4  34.21,38.82 180 bottom
C5  33.93,34.9 180 bottom
C6  54.4,46.23 270 bottom
C7  47.59,36.03 0 bottom
C8  46.67,39.18 270 bottom
C9  45.78,42.52 0 bottom
C10  29.87,45.51 90 bottom
C11  32.42,45.4 90 bottom
C12  45.74,44.81 0 bottom
C13  42.47,43.18 270 bottom
C14  40.42,43.18 270 bottom
C15  38.17,40.35 270 bottom
C16  38.83,35.96 0 bottom
C17  41.6,38.72 180 bottom
C18  3.21,45.94 270 top
C19  7.22,50.62 0 top
C20  2.79,48.71 270 bottom
C21  28.69,26.56 180 top
C22  22.8,19.61 90 top
C23  30.43,2.8 0 bottom
C24  20.05,7.1 270 bottom
C25  16.6,7.1 270 bottom
C26  5.97,3.75 180 bottom
C27  68.93,2.8 0 bottom
C28  58.55,7.1 270 bottom
C29  55.1,7.1 270 bottom
C30  44.47,3.75 180 bottom
D1  24.93,31.42 90 top
D2  22.23,31.34 90 top
D3  19.85,23.32 270 top
D4  13.4,18.41 0 top
D5  5.83,39.3 90 top
IC1  61.98,45.76 0 top
IC2  6.71,45.8 0 top
IC3  43.18,40.39 90 top
IR1  73.09,20.94 0 top
J1  12.17,15.29 180 top
J2  4.56,15.29 180 top
J3  19.78,15.29 180 top
J4  48.1,15.29 180 top
L1  30.35,29.07 0 top
LED1  64.77,65.12 0 top
LED2  46.99,65.12 0 top
LED3  29.21,65.12 0 top
LED4  11.43,65.12 0 top
P1  65.66,35.37 180 top
PAD1  55.63,30.37 0 top
PAD2  25.44,44.8 0 top
PAD3  25.44,42.26 0 top
PAD4  17.78,34.64 0 top
PAD5  15.24,37.18 0 top
PAD6  15.24,34.64 0 top
PAD7  17.78,39.72 0 top
PAD8  17.78,37.18 0 top
PAD9  20.32,37.18 0 top
PAD10  22.86,44.8 0 top
PAD11  20.32,42.26 0 top
PAD12  22.86,42.26 0 top
PAD13  15.24,39.74 0 top
PAD14  12.7,39.72 0 top
PAD15  12.7,37.18 0 top
PAD16  15.24,42.26 0 top
PAD17  17.78,42.26 0 top
PAD18  15.24,44.8 0 top
PAD19  1.8,52.4 0 top
Q1  30.64,36.09 90 top
Q2  30.82,42.58 0 top
Q3  50.83,64.66 90 bottom
Q4  14.98,64.58 90 bottom
Q5  72.24,64.97 0 bottom
Q6  33.16,64.67 90 bottom
Q7  5.83,55.6 270 top
Q8  3.3,50.08 0 top
Q9  9.26,21.6 0 bottom
Q10  38.99,20.4 270 top
Q11  13.35,20.71 270 bottom
Q12  33.3,20.54 270 top
R1  2.84,34.73 90 top
R2  7.02,35.89 180 bottom
R3  25.76,22.56 90 bottom
R4  28.46,22.54 90 bottom
R5  7,33.19 180 bottom
R6  72.39,57.5 90 bottom
R7  69.85,57.5 90 bottom
R8  67.31,57.5 90 bottom
R9  64.77,57.5 90 bottom
R10  59.69,57.5 90 bottom
R11  62.23,57.5 90 bottom
R12  57.15,57.5 90 bottom
R13  54.61,57.5 90 bottom
R14  52.07,57.5 90 bottom
R15  49.53,57.5 90 bottom
R16  46.99,57.5 90 bottom
R17  41.91,57.5 90 bottom
R18  44.45,57.5 90 bottom
R19  39.37,57.5 90 bottom
R20  36.83,57.5 90 bottom
R21  34.29,57.5 90 bottom
R22  31.75,57.5 90 bottom
R23  29.21,57.5 90 bottom
R24  24.13,57.5 90 bottom
R25  26.67,57.5 90 bottom
R26  21.59,57.5 90 bottom
R27  19.05,57.5 90 bottom
R28  16.51,57.5 90 bottom
R29  13.97,57.5 90 bottom
R30  11.43,57.5 90 bottom
R31  6.35,57.5 90 bottom
R32  8.89,57.5 90 bottom
R33  3.81,57.5 90 bottom
R34  3.23,44.16 90 bottom
R35  12.79,46.83 90 top
R36  11.03,50.59 90 bottom
R37  10.82,42.59 90 bottom
R38  15.97,51.37 0 bottom
R39  55.28,32.63 0 top
R40  6.19,20.03 270 bottom
R41  43.29,20.33 180 top
R42  11.71,25.75 180 bottom
R43  7,25.82 0 bottom
R44  11.77,28.63 0 bottom
R45  7.03,28.71 180 bottom
R46  9.68,22.02 0 top
R47  22.45,7.1 270 bottom
R48  29.55,7.1 270 bottom
R49  14.25,7.1 270 bottom
R50  6.95,7.1 270 bottom
R51  4.65,7.1 90 bottom
R52  12.05,7.1 90 bottom
R53  24.75,7.1 90 bottom
R54  31.85,7.1 90 bottom
R55  34.15,7.1 270 bottom
R56  27.05,7.1 270 bottom
R57  9.75,7.1 270 bottom
R58  2.45,7.1 270 bottom
R59  60.95,7.1 270 bottom
R60  68.05,7.1 270 bottom
R61  52.75,7.1 270 bottom
R62  45.45,7.1 270 bottom
R63  43.15,7.1 90 bottom
R64  50.55,7.1 90 bottom
R65  63.25,7.1 90 bottom
R66  70.35,7.1 90 bottom
R67  72.65,7.1 270 bottom
R68  65.55,7.1 270 bottom
R69  48.25,7.1 270 bottom
R70  40.95,7.1 270 bottom
SV1  27.2,16.81 90 top
SV2  37.9,23.95 180 top
SV3  48.45,22.04 270 top
SV4  72.99,40.87 270 top
SV5  37.37,15.95 180 top
SV6  18.33,2.5 0 bottom
SV7  56.98,2.6 0 bottom
SV8  22.86,39.6 180 top
SV9  17.9,48.5 0 top
T1  2.84,29.33 0 top
U$2  59.97,19.88 90 top
U$3  10.01,28.3 0 top
XGND1  20.32,39.72 0 top
XGND2  25.44,47.24 0 top
XGND3  22.86,47.25 0 top
XGND4  20.28,34.64 0 top
XVCC1  27.9,47.2 0 top
XVCC2  27.94,44.8 0 top
XVCC3  12.7,34.64 0 top

### Tracks (layer width: path | path; a pad name or v marks a point on that pad's centre or on a via)
AVCC  (via drill 0.5)
  Top 0.3: v39.45,34.5 38.68,33.73 IC3.4 38.68,31.48 v36.3,29.1 | v39,37.65 36.75,37.65 36.49,37.39 IC3.94 | C21.1 30.09,27.54 L1.2
  Bottom 0.3: v39.45,34.5 39.78,34.98 C16.1 39.78,36.87 v39,37.65 40.05,38.7 C17.1 | v36.3,29.1 31.65,29.1 L1.2
GND  (via drill 0.5, 0.6)
  Top 0.3: IC3.3 38.18,34.27 v37.95,34.5
  Bottom 0.3: v37.95,34.5 37.8,34.65 37.8,35.88 C16.2
  other vias: 53.1,30.75 42.9,34.5 47.1,34.35 48.6,43.2 44.1,46.5 41.1,46.5 36.75,40.35 40.05,40.5 37.2,45.5 36,48.1 69.8,66.5 45.1,64.5 20.6,63.3 17.3,25.4 67.5,50.1
  pour Top (isolate 0.22): 0,12 0,72 75,72 75,12
  pour Bottom (isolate 0.25): 0,72 75,72 75,12 0,12
N$1  (via drill 0.5)
  Top 0.3: v58.8,18.75 55.64,18.75 U$2.12 | IC3.20 46.68,30.87 48.75,28.8 v49.05,28.8
  Bottom 0.3: v58.8,18.75 59.4,19.35 59.4,22.5 53.1,28.8 v49.05,28.8
N$2  (via drill 0.5)
  Top 0.3: IC3.21 47.18,31.27 48.75,29.7 v50.55,29.7 | v59.85,24.15 69.15,14.85 69.1,14.85 U$2.1
  Bottom 0.3: v50.55,29.7 53.1,29.7 58.65,24.15 v59.85,24.15
N$3
  Top 0.3: IC3.22 47.68,31.52 48.6,30.6 51.15,30.6 51.9,29.85 51.9,17.4 52.5,16.8 53.6,16.8 U$2.13
N$4
  Top 0.3: U$2.14 52.5,15 51.15,16.35 51.15,27.45 50.7,27.9 48.3,27.9 48,28.2 48,28.65 46.18,30.47 IC3.19
N$5  (via drill 0.5)
  Top 0.3: v58.2,20.85 55.74,20.85 U$2.11 | IC3.18 45.68,30.07 47.4,28.35 47.4,27.6 48,27 v49.05,27
  Bottom 0.3: v49.05,27 52,27 58.2,20.8 v58.2,20.85
N$6  (via drill 0.5)
  Top 0.3: v59.85,31.95 v62.25,31.95 | IC3.16 44.68,29.87 44.55,29.7 44.55,27.45 44.7,27.3 v46.5,27.3
  Bottom 0.3: v62.25,31.95 63.3,31.95 70.53,24.72 C1.1 | IR1.VS 72.48,17.79 C1.1 | C1.1 70.8,18.06 | v59.85,31.95 50.3,31.95 46.5,28.15 v46.5,27.3
N$7
  Top 0.3: PAD1.1 55.63,26.74 U$2.8
N$8  (via drill 0.5)
  Top 0.3: v59.85,33.45 v62.25,33.45 | IC3.17 45.18,28.92 arc90 v45.45,28.8
  Bottom 0.3: v59.85,33.45 50.95,33.45 49.4,31.9 48.15,31.9 45.45,29.2 v45.45,28.8 | IR1.VO 63.12,33.45 v62.25,33.45
N$9
  Bottom 0.3: R3.1 25.95,21.77 25.95,21.9 27.15,20.7 27.15,15.59 SV1.1
N$10  (via drill 0.5)
  Top 0.3: IC3.89 31.79,39.89 30.7,40.35 29.4,40.35 28.2,39.15 v28.2,34.5
  Bottom 0.3: R3.2 24.34,23.51 22.35,25.5 22.35,27.14 D2.C 22.23,28.53 v28.2,34.5
N$11  (via drill 0.5)
  Top 0.3: IC3.87 32.14,40.89 30.8,41.55 28.95,41.55 27.1,39.7 27.1,37.9 26.1,36.9 26.1,35.2 25.1,34.2 22.05,34.2 20.7,32.85 18.45,32.85 v17.7,32.1
  Bottom 0.3: R2.2 R5.2 8.55,33.15 9.6,32.1 v17.7,32.1
N$12
  Top 0.3: IC3.91 31.2,38.89 Q1.2
  Bottom 0.3: C4.1 30.83,38.82 Q1.2
N$13
  Top 0.3: IC3.92 32.39,38.39 30.9,36.9 30.9,33.74 Q1.1
  Bottom 0.3: C5.1 31.99,34.9 Q1.1
N$14
  Top 0.3: 30.3,48.1 28.45,49.95 24.9,49.95 23.85,51 19.75,51 19.15,51.6 16.65,51.6 15.9,52.35 13.5,52.35 12.45,53.4 6.9,53.4 5.9,54.4 5.9,55.1 5.4,55.6 5.4,55.98 Q7.1 | 30.3,48.1 30.2,48.1 | 30.3,48.1 30.3,47 32.21,45.19 33.11,45.19 33.4,44.9 IC3.79
N$15
  Top 0.3: IC3.35 52.84,38.89 55.8,41.85 55.8,44.25 58.35,46.8 63.02,46.8 IC1.5
N$16
  Top 0.3: IC3.36 52.59,39.39 55.35,42.15 55.35,44.7 58.05,47.4 61.8,47.4 63.15,48.75 63.15,49.02 IC1.6
N$17  (via drill 0.5)
  Top 0.3: IC3.5 39.18,31.23 37.8,29.85 v37.8,28.8 | v28.5,31.35 27.3,31.35 26.4,30.45 17.4,30.45 16.2,31.65 v16.2,33.15
  Bottom 0.3: 37.8,28.65 v37.8,28.8 37.8,30.75 37.05,31.5 28.7,31.5 v28.5,31.35 | v16.2,33.15 10.8,33.15 9.6,34.35 9.6,36.75 9,37.35 6.9,37.35 6.15,36.6 R2.1 5.69,35.89 3.8,34 3.28,33.5 R1.1
N$18  (via drill 0.5)
  Top 0.3: IC3.90 31.41,39.39 30.55,39.75 29.7,39.75 29.4,39.45 v29.4,35.85
  Bottom 0.3: SV5.6 36.77,14.68 35.4,16.05 33.9,16.05 33.6,16.35 33.6,19.35 29.4,23.55 28.42,23.55 | 28.42,23.55 R4.2 | 28.42,23.55 28.42,24.18 26.35,26.25 25.22,26.25 D1.C 24.93,30.33 27.6,33 28.8,33 29.4,33.6 v29.4,35.85
N$19
  Bottom 0.3: SV1.5 R4.1
N$20
  Top 0.3: Q2.2 32.3,42.4 32.81,41.89 IC3.85
  Bottom 0.3: 32.79,44.23 C11.1 32.09,44.12 Q2.2
N$21
  Top 0.3: IC3.86 32.29,41.39 30,42.5 Q2.1
  Bottom 0.3: Q2.1 29.55,44.24 C10.1
N$22
  Top 0.2: SV2.6 31.8,24.2 31.8,25.05 32.85,26.1 32.85,34.95 33.75,35.85 35.14,35.85 IC3.97
N$23
  Top 0.2: SV2.5 34.09,26.36 33.45,27 33.45,34.95 33.9,35.4 IC3.98
N$24
  Top 0.2: SV2.4 36.6,23.98 36.6,25.2 36.3,25.5 35.85,25.5 34.05,27.3 34.05,34.65 34.35,34.95 35.12,34.95 IC3.99
N$25
  Top 0.2: SV2.3 39.15,23.97 39.15,25.35 38.55,25.95 36.15,25.95 34.65,27.45 34.65,34.31 IC3.100
N$26
  Top 0.2: SV2.2 41.7,25.35 40.5,26.55 36.45,26.55 35.25,27.75 35.25,31.05 35.7,31.5 37.2,31.5 37.2,32.37 IC3.1
N$27  (via drill 0.5)
  Top 0.3: IC3.96 33.24,36.39 32.25,35.4 32.25,32.55 31.5,31.95 30,31.95 29.25,32.25 24.45,32.25 24.15,31.95 19.65,31.95 v19.2,31.5
  Bottom 0.3: v19.2,31.5 18.75,31.05 7.8,31.05 6.05,32.8 6.05,33.15 | T1.C 4.3,29.52 4.3,31.4 6.05,33.15 | 6.05,33.15 R5.1
N$28
  Top 0.3: Q7.3 6.83,57.34 7.51,58.02
  Top 0.4: 22.86,60.04 20.84,58.02 7.51,58.02
  Top 0.406: LED1.1 55.13,58.02 42.66,58.02 40.64,60.04 | 40.64,60.04 LED2.1 | 40.64,60.04 38.47,57.87 25.03,57.87 22.86,60.04 LED3.1 | 7.51,58.02 7.1,58.02 5.08,60.04 LED4.1
N$29  (via drill 0.5)
  Top 0.3: v40.35,28.8 40.35,30.15 41.18,30.98 IC3.9
  Bottom 0.3: v40.35,28.8 40.05,28.5 40.05,28.2 37.95,26.1 37.95,17.8 SV5.5
N$30
  Top 0.3: SV5.9 33.6,15.9 43.2,15.9 44.85,17.55 49.35,17.55 50.55,18.75 50.55,25.5 50.1,25.95 46.2,25.95 45.45,26.7 42.75,26.7 41.25,28.2 41.25,30.15 41.68,30.73 IC3.10
N$31  (via drill 0.5)
  Top 0.3: v42.15,28.8 42.18,29.73 IC3.11
  Bottom 0.3: v42.15,28.8 42.15,26.85 40.5,25.2 40.5,21.45 38.7,19.65 38.7,16.35 39.15,15.9 41.1,15.9 41.4,16.2 41.55,16.32 SV5.1
N$32  (via drill 0.5)
  Top 0.3: IC3.12 42.68,29.77 v43.65,28.8
  Bottom 0.3: v43.65,28.8 43.65,25.95 43.05,25.35 43.05,21.45 39.9,18.3 SV5.3
N$33  (via drill 0.5)
  Top 0.3: LED4.3 10.16,59.89 11.4,58.65 20.4,58.65 21.6,59.85 21.6,62.85 22.05,63.3 27,63.3 27.9,62.4 27.9,61.35 LED3.3 28.05,61.2 28.05,60 29.25,58.8 38.1,58.8 39.15,59.85 39.15,62.7 | 39.15,62.7 39.9,63.45 44.85,63.45 45.72,62.52 LED2.3 45.72,60.18 47.1,58.8 54.75,58.8 57.15,61.2 57.15,62.55 58,63.4 63.05,63.4 63.45,63 63.45,61.36 LED1.3 | v37.35,63.3 38.55,63.3 39.15,62.7
  Bottom 0.3: Q6.3 35.98,64.67 v37.35,63.3
N$34
  Bottom 0.3: Q5.3 72.24,66.39 73.2,67.35 73.2,70.8 72.75,71.25 64.55,71.25 64.47,71.17
  Bottom 0.406: LED4.10 10.16,70.2 11.13,71.17 26.97,71.17 27.94,70.2 | 27.94,70.2 LED3.10 | 45.72,70.2 LED2.10 | 45.72,70.2 44.75,71.17 28.91,71.17 27.94,70.2 | 63.5,70.2 62.53,71.17 46.69,71.17 45.72,70.2 | 63.5,70.2 LED1.10 | 63.5,70.2 64.47,71.17
N$35  (via drill 0.5)
  Top 0.3: LED4.7 17.78,69.82 16.35,71.25 14.7,71.25 13.95,70.5 v13.95,66.91
  Top 0.4: 18,69.9 19.27,71.17 34.59,71.17
  Top 0.406: LED1.7 71.12,70.2 70.15,71.17 54.31,71.17 53.34,70.2 | 53.34,70.2 LED2.7 | 53.34,70.2 52.37,71.17 36.53,71.17 35.56,70.2 | LED4.7 17.78,69.68 18,69.9 | 35.56,70.2 LED3.7 | 34.59,71.17 35.56,70.2
  Bottom 0.3: v13.95,66.91 14.54,66.91 15.9,65.55 15.9,64.66 Q4.3
N$36  (via drill 0.5)
  Top 0.3: 52.07,66.39 v52.07,66.58 v52.06,66.59 | 33.02,67.66 33.02,67.63 34.35,66.3 49.44,66.3 50.8,67.66
  Top 0.406: LED1.8 68.58,67.66 67.31,66.39 52.07,66.39 50.8,67.66 LED2.8 | LED3.8 33.02,67.66 32.05,66.69 16.06,66.69 15.24,67.66 LED4.8
  Bottom 0.3: Q3.3 51.83,66.36 v52.06,66.59
N$37
  Bottom 0.406: R6.2 72.39,60.04 LED1.6
N$38
  Bottom 0.406: R7.2 69.85,60.04 LED1.5
N$39
  Bottom 0.406: R8.2 67.31,60.04 LED1.4
N$40
  Bottom 0.406: R9.2 64.77,67.66 LED1.9
N$41
  Bottom 0.3: R11.2 62.23,59.37 61,60.6 61,61.27 LED1.2
N$42
  Bottom 0.406: R10.2 59.69,66.76 60.9,67.95 60.9,68.87 LED1.11
N$43
  Bottom 0.406: R12.2 57.15,67.66 LED1.12
N$44  (via drill 0.6)
  Top 0.3: IC3.50 51.79,46.39 53.7,48.3 53.7,51.75 55.95,54 58.65,54 v59.55,54.9
  Bottom 0.3: v59.55,54.9 59.55,56.41 R10.1
N$45  (via drill 0.6)
  Top 0.3: IC3.48 52.29,45.39 54.6,47.7 54.6,51.15 56.55,53.1 62.85,53.1 v64.65,54.9
  Bottom 0.3: v64.65,54.9 64.65,56.43 R9.1
N$46  (via drill 0.6)
  Top 0.3: IC3.46 52.79,44.39 55.5,47.1 55.5,50.55 57.15,52.2 67.05,52.2 v69.75,54.9
  Bottom 0.3: v69.75,54.9 69.75,56.45 R7.1
N$47  (via drill 0.6)
  Top 0.3: IC3.45 53.04,43.89 56.1,46.95 56.1,50.25 57.6,51.75 67.35,51.75 69.45,53.85 71.25,53.85 v72.3,54.9
  Bottom 0.3: v72.3,54.9 72.3,56.46 R6.1
N$48  (via drill 0.6)
  Top 0.3: IC3.47 52.54,44.89 55.05,47.4 55.05,50.85 56.85,52.65 64.95,52.65 v67.2,54.9
  Bottom 0.3: v67.2,54.9 67.2,56.44 R8.1
N$49  (via drill 0.6)
  Top 0.3: IC3.49 52.04,45.89 54.15,48 54.15,51.45 56.25,53.55 60.75,53.55 v62.1,54.9
  Bottom 0.3: v62.1,54.9 62.1,56.42 R11.1
N$50  (via drill 0.6)
  Top 0.3: IC3.51 49.18,52.33 49.5,52.65 53.85,52.65 56.1,54.9 v57,54.9
  Bottom 0.3: v57,54.9 57,56.4 R12.1
N$51
  Bottom 0.406: R13.2 54.61,60.04 LED2.6
N$52
  Bottom 0.406: R14.2 52.07,60.04 LED2.5
N$53
  Bottom 0.406: R15.2 49.53,60.04 LED2.4
N$54
  Bottom 0.406: R16.2 46.99,67.66 LED2.9
N$55
  Bottom 0.3: R18.2 44.45,58.95 43.18,60.22 LED2.2
N$56
  Bottom 0.406: R17.2 41.91,66.76 43.2,68.05 43.2,68.1 LED2.11
N$57
  Bottom 0.406: R19.2 39.37,67.66 LED2.12
N$58  (via drill 0.6)
  Top 0.3: IC3.59 45.18,51.72 v42,54.9
  Bottom 0.3: v42,54.9 42,56.46 R17.1
N$59  (via drill 0.6)
  Top 0.3: IC3.57 46.18,54.13 v46.95,54.9
  Bottom 0.3: v46.95,54.9 46.95,56.51 R16.1
N$60  (via drill 0.6)
  Top 0.3: IC3.55 47.18,51.83 48.9,53.55 50.7,53.55 v52.05,54.9
  Bottom 0.3: v52.05,54.9 52.05,56.53 R14.1
N$61  (via drill 0.6)
  Top 0.3: IC3.52 48.68,52.58 49.2,53.1 52.05,53.1 53.85,54.9 v54.45,54.9
  Bottom 0.3: v54.45,54.9 54.45,56.39 R13.1
N$62  (via drill 0.6)
  Top 0.3: IC3.56 46.68,52.08 v49.5,54.9
  Bottom 0.3: v49.5,54.9 49.5,56.52 R15.1
N$63  (via drill 0.6)
  Top 0.3: IC3.58 45.68,53.77 v44.55,54.9
  Bottom 0.3: v44.55,54.9 44.55,56.45 R18.1
N$64  (via drill 0.6)
  Top 0.3: IC3.60 44.68,51.32 42,54 40.35,54 v39.45,54.9
  Bottom 0.3: v39.45,54.9 39.45,56.47 R19.1
N$65
  Top 0.4: J2.2 6.31,16.64 2.1,20.85 2.1,21.98 R46.1 | R46.1 2.18,21.9 | U$3.P$1 6.86,26.82 R46.1
  Bottom 0.4: R46.1 2.09,22.05 3.45,22.05 6,24.6 6,25.77 R43.2
N$66
  Bottom 0.406: R20.2 36.83,60.04 LED3.6
N$67
  Bottom 0.406: R21.2 34.29,60.04 LED3.5
N$68
  Bottom 0.406: R22.2 31.75,60.04 LED3.4
N$69
  Bottom 0.406: R23.2 29.21,67.66 LED3.9
N$70
  Bottom 0.3: R25.2 26.67,59.33 25.4,60.6 LED3.2
N$71
  Bottom 0.406: R24.2 24.13,66.76 25.35,67.95 25.35,68.88 LED3.11
N$72
  Bottom 0.406: R26.2 21.59,67.66 LED3.12
N$73  (via drill 0.6)
  Top 0.3: IC3.68 40.68,50.52 39.9,51.3 34.05,51.3 32.25,53.1 27,53.1 25.95,54.15 24.9,54.15 v24.15,54.9
  Bottom 0.3: v24.15,54.9 24.15,56.53 R24.1
N$74  (via drill 0.6)
  Top 0.3: IC3.66 41.68,51.32 40.8,52.2 34.65,52.2 32.85,54 30.15,54 v29.25,54.9
  Bottom 0.3: v29.25,54.9 29.25,56.51 R23.1
N$75  (via drill 0.6)
  Top 0.3: IC3.62 43.68,50.82 41.4,53.1 36.15,53.1 v34.35,54.9
  Bottom 0.3: v34.35,54.9 34.35,56.49 R21.1
N$76  (via drill 0.6)
  Top 0.3: IC3.61 44.18,51.07 41.7,53.55 38.25,53.55 v36.9,54.9
  Bottom 0.3: v36.9,54.9 36.9,56.48 R20.1
N$77  (via drill 0.6)
  Top 0.3: IC3.65 42.18,51.57 41.1,52.65 34.95,52.65 32.7,54.9 v31.8,54.9
  Bottom 0.3: v31.8,54.9 31.8,56.5 R22.1
N$78  (via drill 0.6)
  Top 0.3: IC3.67 41.18,50.92 40.35,51.75 34.35,51.75 32.55,53.55 28.2,53.55 v26.85,54.9
  Bottom 0.3: v26.85,54.9 R25.1
N$79  (via drill 0.6)
  Top 0.3: IC3.69 40.18,50.23 39.6,50.85 33.75,50.85 31.95,52.65 26.7,52.65 25.65,53.7 24.6,53.7 24.45,53.85 22.65,53.85 v21.6,54.9
  Bottom 0.3: v21.6,54.9 R26.1
N$80
  Bottom 0.406: R27.2 19.05,60.04 LED4.6
N$81
  Bottom 0.406: R28.2 16.51,60.04 LED4.5
N$82
  Bottom 0.406: R29.2 13.97,60.04 LED4.4
N$83
  Bottom 0.406: R30.2 11.43,67.66 LED4.9
N$84
  Bottom 0.406: R32.2 8.89,60.04 LED4.2
N$85
  Bottom 0.406: R31.2 6.35,66.61 7.65,67.95 7.65,68.9 LED4.11
N$86
  Bottom 0.406: R33.2 3.81,67.66 LED4.12
N$87  (via drill 0.5)
  Top 0.3: v34.4,48.05 34.4,48 35.3,47.1 36.3,47.1 36.45,46.95 36.45,46.2 36.15,45.9 IC3.77
  Bottom 0.3: R31.1 6.35,55.75 8.65,53.45 32.25,53.45 34.4,51.4 v34.4,48.05
N$88  (via drill 0.6)
  Top 0.3: v11.55,54.85 12.5,54.85 13.95,53.4 16.5,53.4 17.25,52.65 19.75,52.65 20.5,51.9 24.45,51.9 25.5,50.85 30.75,50.85 32.55,49.05 37.18,49.05 IC3.75
  Bottom 0.3: R30.1 11.43,54.97 v11.55,54.85
N$89  (via drill 0.6)
  Top 0.3: IC3.71 39.18,49.62 38.85,49.95 33.15,49.95 31.35,51.75 26.1,51.75 25.05,52.8 21.3,52.8 20.25,53.85 17.7,53.85 v16.65,54.9
  Bottom 0.3: v16.65,54.9 16.65,56.41 R28.1
N$90  (via drill 0.6)
  Top 0.3: IC3.70 39.68,50.02 39.3,50.4 33.45,50.4 31.65,52.2 26.4,52.2 25.35,53.25 21.7,53.25 20.05,54.9 v19.2,54.9
  Bottom 0.3: v19.2,54.9 19.2,56.4 R27.1
N$91  (via drill 0.6)
  Top 0.3: IC3.72 38.68,49.37 38.55,49.5 32.85,49.5 31.05,51.3 25.8,51.3 24.75,52.35 20.9,52.35 20,53.25 17.4,53.25 16.65,54 15,54 v14.1,54.9
  Bottom 0.3: v14.1,54.9 14.1,56.42 R29.1
N$92  (via drill 0.6)
  Top 0.3: IC3.76 34.43,46.42 30.45,50.4 25.2,50.4 24.15,51.45 20.15,51.45 19.55,52.05 16.95,52.05 16.2,52.8 13.8,52.8 12.75,53.85 9.75,53.85 9,54.6 v9,54.85
  Bottom 0.3: v9,54.85 8.89,54.86 R32.1
N$93  (via drill 0.5)
  Top 0.3: v31.3,48.1 33.99,45.39 IC3.78
  Bottom 0.3: R33.1 3.81,56.49 7.5,52.8 29.1,52.8 31.35,50.55 31.3,48.2 v31.3,48.1
N$94
  Bottom 0.4: J1.2 17.04,18.41 D4.A
N$95  (via drill 0.5)
  Top 0.3: IC3.80 33.21,44.39 32.9,44.7 32.01,44.69 29.8,46.8 29.8,47.8 29.7,47.9 28.15,49.5 24.6,49.5 23.55,50.55 19.35,50.55 18.75,51.15 16.35,51.15 15.6,51.9 13.2,51.9 12.45,52.65 4.65,52.65 3.6,53.7 3.6,63 4.2,63.6 14.2,63.6 15,64.4 27.4,64.4 27.9,63.9 v30.75,63.9
  Bottom 0.3: Q6.1 30.93,63.72 v30.75,63.9
N$96  (via drill 0.5)
  Top 0.3: 47.7,65.43 v48.27,65.43 | v67.35,64.95 67.2,64.95 66.75,65.4 47.73,65.4 47.7,65.43 | 47.7,65.43 30.87,65.43 v30.75,65.55 30.63,65.43 13.62,65.43 13.02,66.03 v12.57,66.03 12.3,66 4.5,66 0.9,62.4 0.9,53.3 PAD19.1 3.05,51.15 3.37,51.15 | Q7.2 4.83,53.97 v5.25,53.55 | 3.37,51.15 v4.65,51.15 | 3.37,51.15 Q8.3
  Bottom 0.3: Q5.2 70.31,64.95 v67.35,64.95 | v30.75,65.55 32.09,65.55 Q6.2 | 5.25,51.75 v5.25,53.55 | v4.65,51.15 5.25,51.75 | 5.25,51.75 5.46,51.54 R36.2 14.6,51.54 R38.2 | Q4.2 13.07,65.53 v12.57,66.03 | Q3.2 48.45,65.61 v48.27,65.43
  Bottom 0.4: C20.1 3.83,51.15 v4.65,51.15
N$97  (via drill 0.5)
  Top 0.3: v37.2,43.95 37.14,43.89 IC3.81
  Bottom 0.3: Q5.1 73.19,60.91 73.8,60.3 73.8,54.6 73.05,53.85 68.95,53.85 68.6,53.5 54.6,53.5 53.3,52.2 53.3,49.4 52.1,48.2 39.6,48.2 38.6,47.2 38.6,44.55 38.5,44.45 37.8,43.95 v37.2,43.95
N$98  (via drill 0.5)
  Top 0.3: v12.63,64.53 10.2,64.5 4.05,64.5 1.5,61.95 1.5,55.05 4.5,52.05 12.3,52.05 12.9,51.45 15.3,51.45 16.2,50.55 18.5,50.55 18.95,50.1 23.25,50.1 24.3,49.05 27.85,49.05 29.3,47.6 29.3,46.6 31.71,44.19 32.71,44.19 33.5,43.4 IC3.82
  Bottom 0.3: Q4.1 13.53,63.63 v12.63,64.53
N$99  (via drill 0.5)
  Top 0.3: IC3.41 52.09,41.89 52.5,42.3 52.5,42.9 52.8,43.2 53.1,43.2 57.75,47.85 58.8,47.85 59.4,48.45 59.4,50.55 60.15,51.3 67.8,51.3 69.75,53.25 71.55,53.25 72.15,53.85 72.9,53.85 73.8,54.75 73.8,61.8 72.2,63.4 64.95,63.4 64,64.35 55.95,64.35 55.45,63.85 v54.85,63.85
  Bottom 0.3: v54.85,63.85 52.9,63.85 52.35,63.3 50.24,63.3 Q3.1
N$100
  Top 0.3: Q8.1 2.35,47.75 C18.1 3.56,46.89
  Top 0.4: IC2.1 5.7,44.9 3.71,46.89 C18.1
N$101  (via drill 0.5)
  Top 0.3: IC2.4 7.84,47.21 7.65,47.55 v7.65,48.45
  Bottom 0.3: v7.65,48.45 7.65,45.15 5.85,43.35 5.84,42.15 D5.2 5.92,42.05
  Bottom 0.4: 5.92,42.05 4.39,42.05 R34.1
N$102
  Bottom 0.3: R36.1 12.42,49.64 R35.E
N$103
  Bottom 0.3: R35.A 11.53,44.29 R37.2
N$104  (via drill 0.5)
  Top 0.3: P1.2 62.58,35.97 v58.5,36 58.5,34.9 R39.2 | v41.4,34.5 40.95,34.5 39.9,33.45 39.75,33.45 39.68,33.38 IC3.6
  Bottom 0.3: v58.5,36 52.2,36 49.1,32.85 42.9,32.85 v41.4,34.5
N$105  (via drill 0.5)
  Top 0.3: v7.65,43.2 IC2.3
  Bottom 0.3: R35.S 10.25,45.8 v7.65,43.2
N$106  (via drill 0.6)
  Top 0.3: IC3.40 52.79,41.39 v53.55,42.15
  Bottom 0.3: v53.55,42.15 55.5,42.15 57.55,40.1 63.47,40.1 P1.1
N$107
  Top 0.3: SV4.9 72.07,32.03 68.85,35.25 65.1,35.25 63.3,37.05 58.05,37.05 54.9,33.9 50.69,33.9 IC3.25
N$108
  Top 0.3: IC3.26 54.49,34.39 57.9,37.65 63.45,37.65 65.3,35.8 70.3,35.8 71.58,34.52 SV4.8
N$109
  Top 0.3: IC3.27 53.94,34.89 57.45,38.4 63.6,38.4 65.1,36.9 70.8,36.9 70.96,37.06 SV4.7
N$110
  Top 0.3: IC3.28 53.54,35.39 57.15,39 71.4,39 71.9,39.5 SV4.6
N$111
  Top 0.3: IC3.29 53.14,35.89 56.85,39.6 66.9,39.6 69.3,42 72.73,42 SV4.5
N$112
  Top 0.3: IC3.30 52.74,36.39 56.55,40.2 66.3,40.2 68.85,42.75 70.91,42.75 SV4.4
N$113
  Top 0.3: IC3.31 52.49,36.89 57,41.4 57,43.95 58.8,45.75 66.3,45.75 66.75,46.2 67.72,47.2 67.92,47.4 71.1,47.4 71.28,47.22 SV4.3
N$114
  Top 0.3: IC3.32 52.09,37.39 56.4,41.7 56.4,44.1 58.65,46.35 65.7,46.35 68.25,48.9 69.13,49.75 SV4.2
N$115
  Bottom 0.4: D4.C 8.95,19.05 8.4,19.05 | R40.2 6.22,19.05 8.4,19.05 | Q9.2 8.4,20.51 8.4,19.05
N$116
  Bottom 0.3: R40.1 6.9,21.6 9.2,21.6 Q9.1 10.25,20.7 Q11.3
N$117
  Bottom 0.3: 17.27,22.05 17.25,22.8 14.4,25.65 13.21,25.65 R42.2 12.81,25.41 11.4,24 9.75,24 9.3,23.55 9.3,22.64 Q9.3
  Bottom 0.4: 17.27,22.05 R46.2
N$118  (via drill 0.5)
  Top 0.3: IC3.2 37.68,31.23 37.05,30.6 v36.3,30.6 | v16.05,30 27.3,30 27.75,30.45 v30.45,30.45
  Bottom 0.3: R43.1 7.95,28.68 R45.2 7.95,29.7 8.7,30.45 15.65,30.45 v16.05,30 | v36.3,30.6 36.15,30.45 v30.45,30.45
N$119  (via drill 0.5)
  Top 0.3: IC3.95 32.84,36.89 31.8,35.7 31.8,32.85 31.35,32.55 30.15,32.55 28.95,33.15 v22.65,33.15
  Bottom 0.3: R42.1 10.76,28.57 R44.2 10.8,29.55 11.1,29.85 14.55,29.85 15.75,28.65 18.3,28.65 22.65,33 | 22.65,33 22.65,32.85 | 22.65,33 v22.65,33.15
N$120  (via drill 0.5)
  Top 0.3: IC3.37 49.64,39.89 v49.05,39.3
  Bottom 0.3: J4.2 50.16,15.45 60.3,15.45 61.35,16.5 61.35,25.05 60.75,25.65 60.75,37.35 59.4,38.7 55.3,38.7 54.7,39.3 v49.05,39.3
N$121  (via drill 0.5)
  Top 0.3: IC3.38 49.01,40.39 v48.6,40.8
  Bottom 0.3: v48.6,40.8 48.85,40.55 54.85,40.55 56.1,39.3 59.55,39.3 61.35,37.5 61.35,25.8 61.95,25.2 61.95,16.35 58.8,13.2 48,13.2 46.35,14.85 J4.1
N$122  (via drill 0.5)
  Top 0.3: IC3.42 47.91,42.39 47.55,42.75 47.55,44.41 49.65,46.5 49.65,46.65 51.9,48.9 v51.9,51.6
  Bottom 0.3: v51.9,51.6 41.3,51.6 36.9,47.2 35.7,47.2 34.8,46.3 34.8,41.7 34.1,41 29.2,41 27.8,42.44 PAD2.1
N$123  (via drill 0.5)
  Top 0.3: IC3.88 31.94,40.39 30.8,40.95 29.1,40.95 27.6,39.4 27.6,37.35 27,36.75 v27,35.85
  Bottom 0.3: v27,35.85 27,35.15 21.15,29.3 21.15,27.75 19.35,25.95 19.35,21.6 18.1,20.35 16.3,20.35 Q11.1
N$124
  Top 0.3: Q10.3 34.84,20.4 Q12.3 29.41,20.54 29.1,20.85 21.76,20.85 C22.2
N$125  (via drill 0.5)
  Top 0.3: IC3.15 44.18,31.13 v43.65,30.6 | Q12.1 32.91,21.9 v35.4,21.9 37.44,21.9 Q10.1 38.55,21.9 40.77,21.9 R41.2
  Bottom 0.3: v43.65,30.6 40.05,30.6 39.3,29.85 39.3,28.5 36.9,26.1 36,26.1 35.4,25.5 v35.4,21.9
N$126
  Top 0.4: J3.2 21.53,16.94 C22.1
N$127  (via drill 0.5)
  Top 0.3: IC3.39 50.01,40.89 49.05,41.85 47.7,41.85 46.95,42.45 46.95,44.55 49.05,46.65 49.05,46.8 49.95,47.7 50.55,48.33 50.6,48.38 v50.6,50
  Bottom 0.3: v50.6,50 50.5,49.9 40.4,49.9 37.1,46.6 36,46.6 35.5,46.1 35.5,41.5 34.4,40.4 27.3,40.4 PAD3.1
N$128
  Top 0.3: IC3.7 40.18,31.48 38.7,30 38.7,27.6 39.3,27 40.95,27 42.15,25.8 44.7,25.8 45.6,24.9 45.6,22.35 SV3.3
N$129
  Top 0.3: IC3.8 40.68,31.23 39.3,29.85 39.3,27.9 39.75,27.45 41.25,27.45 42.45,26.25 45,26.25 46.05,25.2 46.05,23.69 47.1,22.64 47.7,22.05 48.16,22.04 SV3.2
N$130
  Bottom 0.2: R58.1 2.5,7.83 | 34.3,8.4 34.3,7.68 R55.1 34.15,8.55 33.3,9.4 28,9.4 27.05,8.45 R56.1 | 27,8.4 27,7.83 R56.1 | R57.1 9.7,7.8 | SV6.6 10,2.5 8.7,1.2 3.7,1.2 0.8,4.1 0.8,7.6 1.25,8.05 R58.1 | R57.1 9.75,8.35 8.7,9.4 3,9.4 2.45,8.85 R58.1 | R57.1 9.75,8.45 10.7,9.4 26,9.4 27.05,8.35 R56.1
N$131
  Bottom 0.3: 25.44,37.01 D1.A 24.85,36.42 D2.A 22.23,37.23 22.86,37.86 SV8.2
N$132  (via drill 0.5)
  Top 0.3: C19.1 6.27,49.27 v5.7,48.7 5.7,47.17 IC2.5
  Top 0.4: SV9.1 13.96,47.1 12.4,47.1 10.1,49.4 v9.6,49.4
  Bottom 0.3: R34.2 5.7,47.58 v5.7,48.7
  Bottom 0.4: v9.6,49.4 6.4,49.4 v5.7,48.7
N$134
  Bottom 0.2: 7.12,7.78 R50.1 R51.2
N$135
  Bottom 0.2: R52.2 R49.1
N$136
  Bottom 0.2: R47.1 R53.2
N$137
  Bottom 0.2: R48.1 R54.2
N$138
  Bottom 0.2: R54.1 R55.2
N$139
  Bottom 0.2: R53.1 R56.2
N$140
  Bottom 0.2: 12.16,5.93 R52.1 R57.2
N$141
  Bottom 0.2: 2.46,5.87 R58.2 R51.1
N$143
  Bottom 0.2: R63.2 R62.1
N$144
  Bottom 0.2: R64.2 R61.1
N$145
  Bottom 0.2: R59.1 R65.2
N$146
  Bottom 0.2: R60.1 R66.2
N$147
  Bottom 0.2: R66.1 R67.2
N$148
  Bottom 0.2: R65.1 R68.2
N$149
  Bottom 0.2: R69.2 R64.1
N$150
  Bottom 0.2: R70.2 R63.1
N$151
  Bottom 0.2: R67.1 72.65,8.65 71.9,9.4 66.3,9.4 65.6,8.7 65.6,8.1 R68.1 65.55,8.75 64.9,9.4 48.9,9.4 48.3,8.8 48.3,8.1 R69.1 48.25,8.85 47.8,9.4 41.5,9.4 41,8.9 41,8.1 R70.1 40.9,8 39.9,8 39.3,7.4 39.3,2.2 40.7,0.8 48.9,0.8 50.63,2.53 SV7.6
N$156
  Bottom 0.6: PAD5.1 PAD6.1 PAD4.1
N$157
  Bottom 0.6: PAD9.1 PAD8.1 PAD7.1
N$158
  Bottom 0.6: PAD11.1 PAD12.1 PAD10.1
N$159
  Bottom 0.6: PAD15.1 PAD14.1 12.72,39.74 PAD13.1
N$160
  Bottom 0.6: PAD17.1 PAD16.1 PAD18.1
NT1
  Top 0.2: 6.5,4.9 7,4.4 13.12,4.4 14.52,3 SV6.5
  Bottom 0.2: SV6.5 14.52,3.78 13.6,4.7 10.2,4.7 9.2,3.7 6.97,3.7 C26.2 6.92,6.12 R50.2
  pour Top (no thermals): 1.2,8.7 6.7,8.7 6.7,8.5 1.7,8.5 1.7,7.5 6.7,7.5 6.7,7.4 1.7,7.4 1.7,6.4 6.7,6.4 6.7,6.3 1.7,6.3 1.7,5.3 6.7,5.3 6.7,4.9 1.2,4.9
NT2
  Top 0.2: 16.2,5.1 17.06,4.24 SV6.4
  Bottom 0.2: R49.2 C25.2 17.06,5.69 SV6.4
  pour Top (no thermals): 10.7,8.7 16.2,8.7 16.2,8.5 11.2,8.5 11.2,7.5 16.2,7.5 16.2,7.4 11.2,7.4 11.2,6.4 16.2,6.4 16.2,6.3 11.2,6.3 11.2,5.3 16.2,5.3 16.2,4.9 10.7,4.9
NT3
  Top 0.2: 20.8,6 19.6,4.8 SV6.3
  Bottom 0.2: R47.2 C24.2 19.6,5.7 SV6.3
  pour Top (no thermals): 20.3,8.7 25.8,8.7 25.8,8.5 20.8,8.5 20.8,7.5 25.8,7.5 25.8,7.4 20.8,7.4 20.8,6.4 25.8,6.4 25.8,6.3 20.8,6.3 20.8,5.3 25.8,5.3 25.8,4.9 20.3,4.9
NT4
  Top 0.2: 30.4,5.7 29.1,4.4 23,4.4 22.14,3.54 SV6.2
  Bottom 0.2: SV6.2 22.14,3.14 23.5,4.5 29.3,4.5 | R48.2 29.3,5.8 29.3,4.5 | C23.2 29.3,3.18 29.3,4.5
  pour Top (no thermals): 29.8,8.7 35.3,8.7 35.3,8.5 30.6,8.5 30.6,7.5 35.3,7.5 35.3,7.4 30.6,7.4 30.6,6.4 35.3,6.4 35.3,6.3 30.6,6.3 30.6,5.3 35.3,5.3 35.3,4.9 29.8,4.9
NTGND
  Bottom 0.2: C23.1 31.2,2.62 31.2,1.8 30.8,1.4 25.3,1.4 24.68,2.02 SV6.1 24.68,1.48 23.9,0.7 18.3,0.7 | C26.1 5.1,3.67 5.1,2.6 5.6,2.1 8.2,2.1 10.5,4.3 12.6,4.3 13.2,3.7 13.2,1.2 13.7,0.7 18.3,0.7 | 18.3,0.7 18.3,8 18.25,8.05 | 20,8 C24.1 18.25,8.05 | 18.25,8.05 C25.1
  pour Top (isolate 0.2, rank 2, no thermals): 0.4,9.6 35.7,9.6 35.7,0.5 0.4,0.5
NU1
  Top 0.2: 39.7,4.7 39.7,4.3 40,3.9 48.9,3.9 49.4,4.4 52.5,4.4 53.17,3.73 SV7.5
  Bottom 0.2: R62.2 45.42,6.15 C30.2 48.55,3.75 49.6,4.8 52.2,4.8 53.1,3.9 53.1,2.67 SV7.5
  pour Top (no thermals): 39.5,8.9 47.9,8.9 39.8,8.5 39.8,7.6 47.9,7.6 39.9,6.8 39.9,6 47.9,6 39.9,5.1 39.9,4.5 39.5,4.5
NU2
  Top 0.2: 55.7,5.1 SV7.4
  Bottom 0.2: R61.2 C29.2 55.71,6.15 SV7.4
  pour Top (no thermals): 48.5,8.9 48.5,8.5 40.3,8.1 48.5,8.1 48.5,7.3 40.3,6.4 48.5,6.4 48.5,5.6 40.3,4.7 60.8,4.7 52.6,5.7 52.6,6.4 60.8,6.4 52.6,7.3 52.6,8.1 60.8,8.1 52.6,8.5 52.6,8.9
NU3
  Top 0.2: 61.6,5 61,4.4 58.6,4.4 58.3,4.1 58.3,2.65 SV7.3
  Bottom 0.2: R59.2 C28.2 58.25,6.15 SV7.3
  pour Top (no thermals): 72.9,8.9 53.1,8.9 61.3,8.5 61.3,7.7 53.1,7.7 61.3,6.7 61.3,6 53.2,6 61.3,5 61.3,4.7 65.2,4.7 65.2,5.1 72.9,5.7 65.2,5.7 65.2,6.4 72.8,7.7 65.1,7.7 65.1,8.5
NU4
  Top 0.2: 67.4,4.8 65.9,4.4 61.8,4.4 60.79,3.39 SV7.2
  Bottom 0.2: R60.2 67.98,6.15 67.98,4.6 | 67.98,4.6 C27.2 | SV7.2 61,2.81 61,3.8 61.8,4.6 67.98,4.6
  pour Top (no thermals): 73.9,4.7 65.6,4.7 73.4,5.3 73.4,6.1 65.6,6.1 73.4,7.4 73.4,8.1 65.6,8.1 73.4,8.5 73.4,8.9 73.9,8.9
NUGND
  Bottom 0.2: 57,8.05 C29.1 | 57,8.05 C28.1 | SV7.1 63.3,2.6 63.3,0.8 | 63.3,0.8 63.1,0.6 57.4,0.6 57,1 | 57,1 57,8.05 | C27.1 69.8,2.72 69.8,1.5 68.9,0.6 63.5,0.6 63.3,0.8 | C30.1 43.52,3.38 45.1,1.8 47.3,1.8 49.9,4.4 51.5,4.4 51.9,4 51.9,1.3 52.6,0.6 56.6,0.6 57,1
  pour Top (isolate 0.2, rank 2, no thermals): 38.8,9.8 74.8,9.8 74.8,0.2 38.8,0.2
VCC  (via drill 0.5)
  Top 0.3: IC3.14 43.68,33.78 v44.4,34.5 | IC3.24 48.68,34.27 v48.6,34.35 | IC3.34 49.21,38.39 v48.75,37.8 | IC3.44 49.84,43.39 v49.35,44.7 | v46.35,46.5 46.8,46.5 47.68,47.38 IC3.54 | IC3.74 37.68,46.92 38.1,46.5 v39.6,46.5 | IC3.64 42.68,46.58 v42.6,46.5 | v38.55,42.9 v38.54,42.89 IC3.83 33.26,42.89 32.5,43.65 29.09,43.65 XVCC2.1 | SV4.10 71.76,29.44 66.95,34.35 60.45,34.35 v59.85,34.95 59.7,34.65 59.25,34.65 58.8,34.2 58.8,30.68 C3.1 59.1,30.26 58.8,30.26 58.8,25.95 57.73,24.88 U$2.9 | 4.25,48.82 Q8.2 | SV1.2 27,15.3 27.15,15.45 29.4,15.45 30.6,16.65 30.6,17.7 31.35,18.45 34.95,18.45 v36,19.5 37.94,19.5 Q10.2
  Top 0.4: L1.1 20.38,29.07 D3.C 19.7,28.25 18,28.2 13.3,28.2 U$3.P$2 13.35,30.75 10.8,33.3 10.8,34.7 | 10.8,34.7 10.8,35.1 | v44.4,34.5 44.25,34.8 42.9,36.15 37.8,36.15 36.9,35.25 36.9,34.05 v35.55,32.7 | XVCC3.1 10.86,34.64 10.8,34.7 | 4.25,48.82 2.97,50.1 1.7,50.1 1.2,49.6 1.2,44.1 6.6,38.7 6.6,38.2 9.7,35.1 10.8,35.1 | 10.8,35.1 10.8,44.8 12.4,46.4 16,46.4 17.7,48.1 SV9.2
  Bottom 0.3: IC1.3 63.25,45.2 61.5,46.95 58.05,46.95 | 54.63,46.95 58.05,46.95 | 54.63,46.95 C6.1 | IC1.8 58.17,47.07 58.05,46.95 | v44.4,34.5 44.4,36.14 C2.1 44.25,35.98 44.25,38.4 45,39.15 | v48.6,34.35 48.6,35.97 C7.1 48.75,36.24 v48.75,37.8 | 47.25,40.13 C8.1 45.98,40.13 45,39.15 | v46.35,46.5 46.35,45.37 C12.1 | 54.63,46.95 49.88,46.95 49.88,46.88 47.7,44.7 | v39.6,46.5 39.6,44.8 C14.1 | C13.1 C14.1 | C15.1 38.55,41.68 v38.55,42.9 38.55,43.01 C14.1 | v59.85,34.95 59.85,36.3 58.35,37.8 v48.75,37.8 | C12.1 46.69,42.68 46.65,42.72 46.65,42.59 C9.1 46.73,40.66 47.25,40.13 | v48.75,37.8 48,38.55 48,39.3 47.25,40.05 47.25,40.13 | SV5.4 39.47,14.68 38.25,15.9 36.75,15.9 36,16.65 v36,19.5 36,19.65 32.85,22.8 32.85,25.3 L1.1 29.1,29.05 | 47.7,44.7 47.25,44.7 C12.1 | 47.7,44.7 v49.35,44.7 | C12.1 46.65,44.85 | v42.6,46.5 42.6,44.26 C13.1 | C13.1 43.77,44.13 43.8,44.1 43.8,40.35 45,39.15
  Bottom 0.4: v35.55,32.7 35.25,32.4 27.9,32.4 27.15,31.65 27.15,30.6 28.68,29.07 L1.1
  Bottom 0.6: XVCC2.1 XVCC1.1

### Text on the board
Bottom: Minimatrix | Malte | Marwedel | (c)2014
tPlace: GND | GND | PE7 | PE4 | GND | GND
tNames: LED+ | Minimatrix | GND | VCC | VCC | PORTD | VCC | ANT | VCC | GND | GND | PDI | PB3 | 2.2 - 3.3V | JTAG | PB2 | - Bat + | - Solar + | - Sp + | TXD0 RXD0